# Altium project 3562.PrjPcb (part 3 of 5)

## Sheet P07_MICRO SD_FAN_ARM JTAG.SchDoc
size 420 x 297 mm
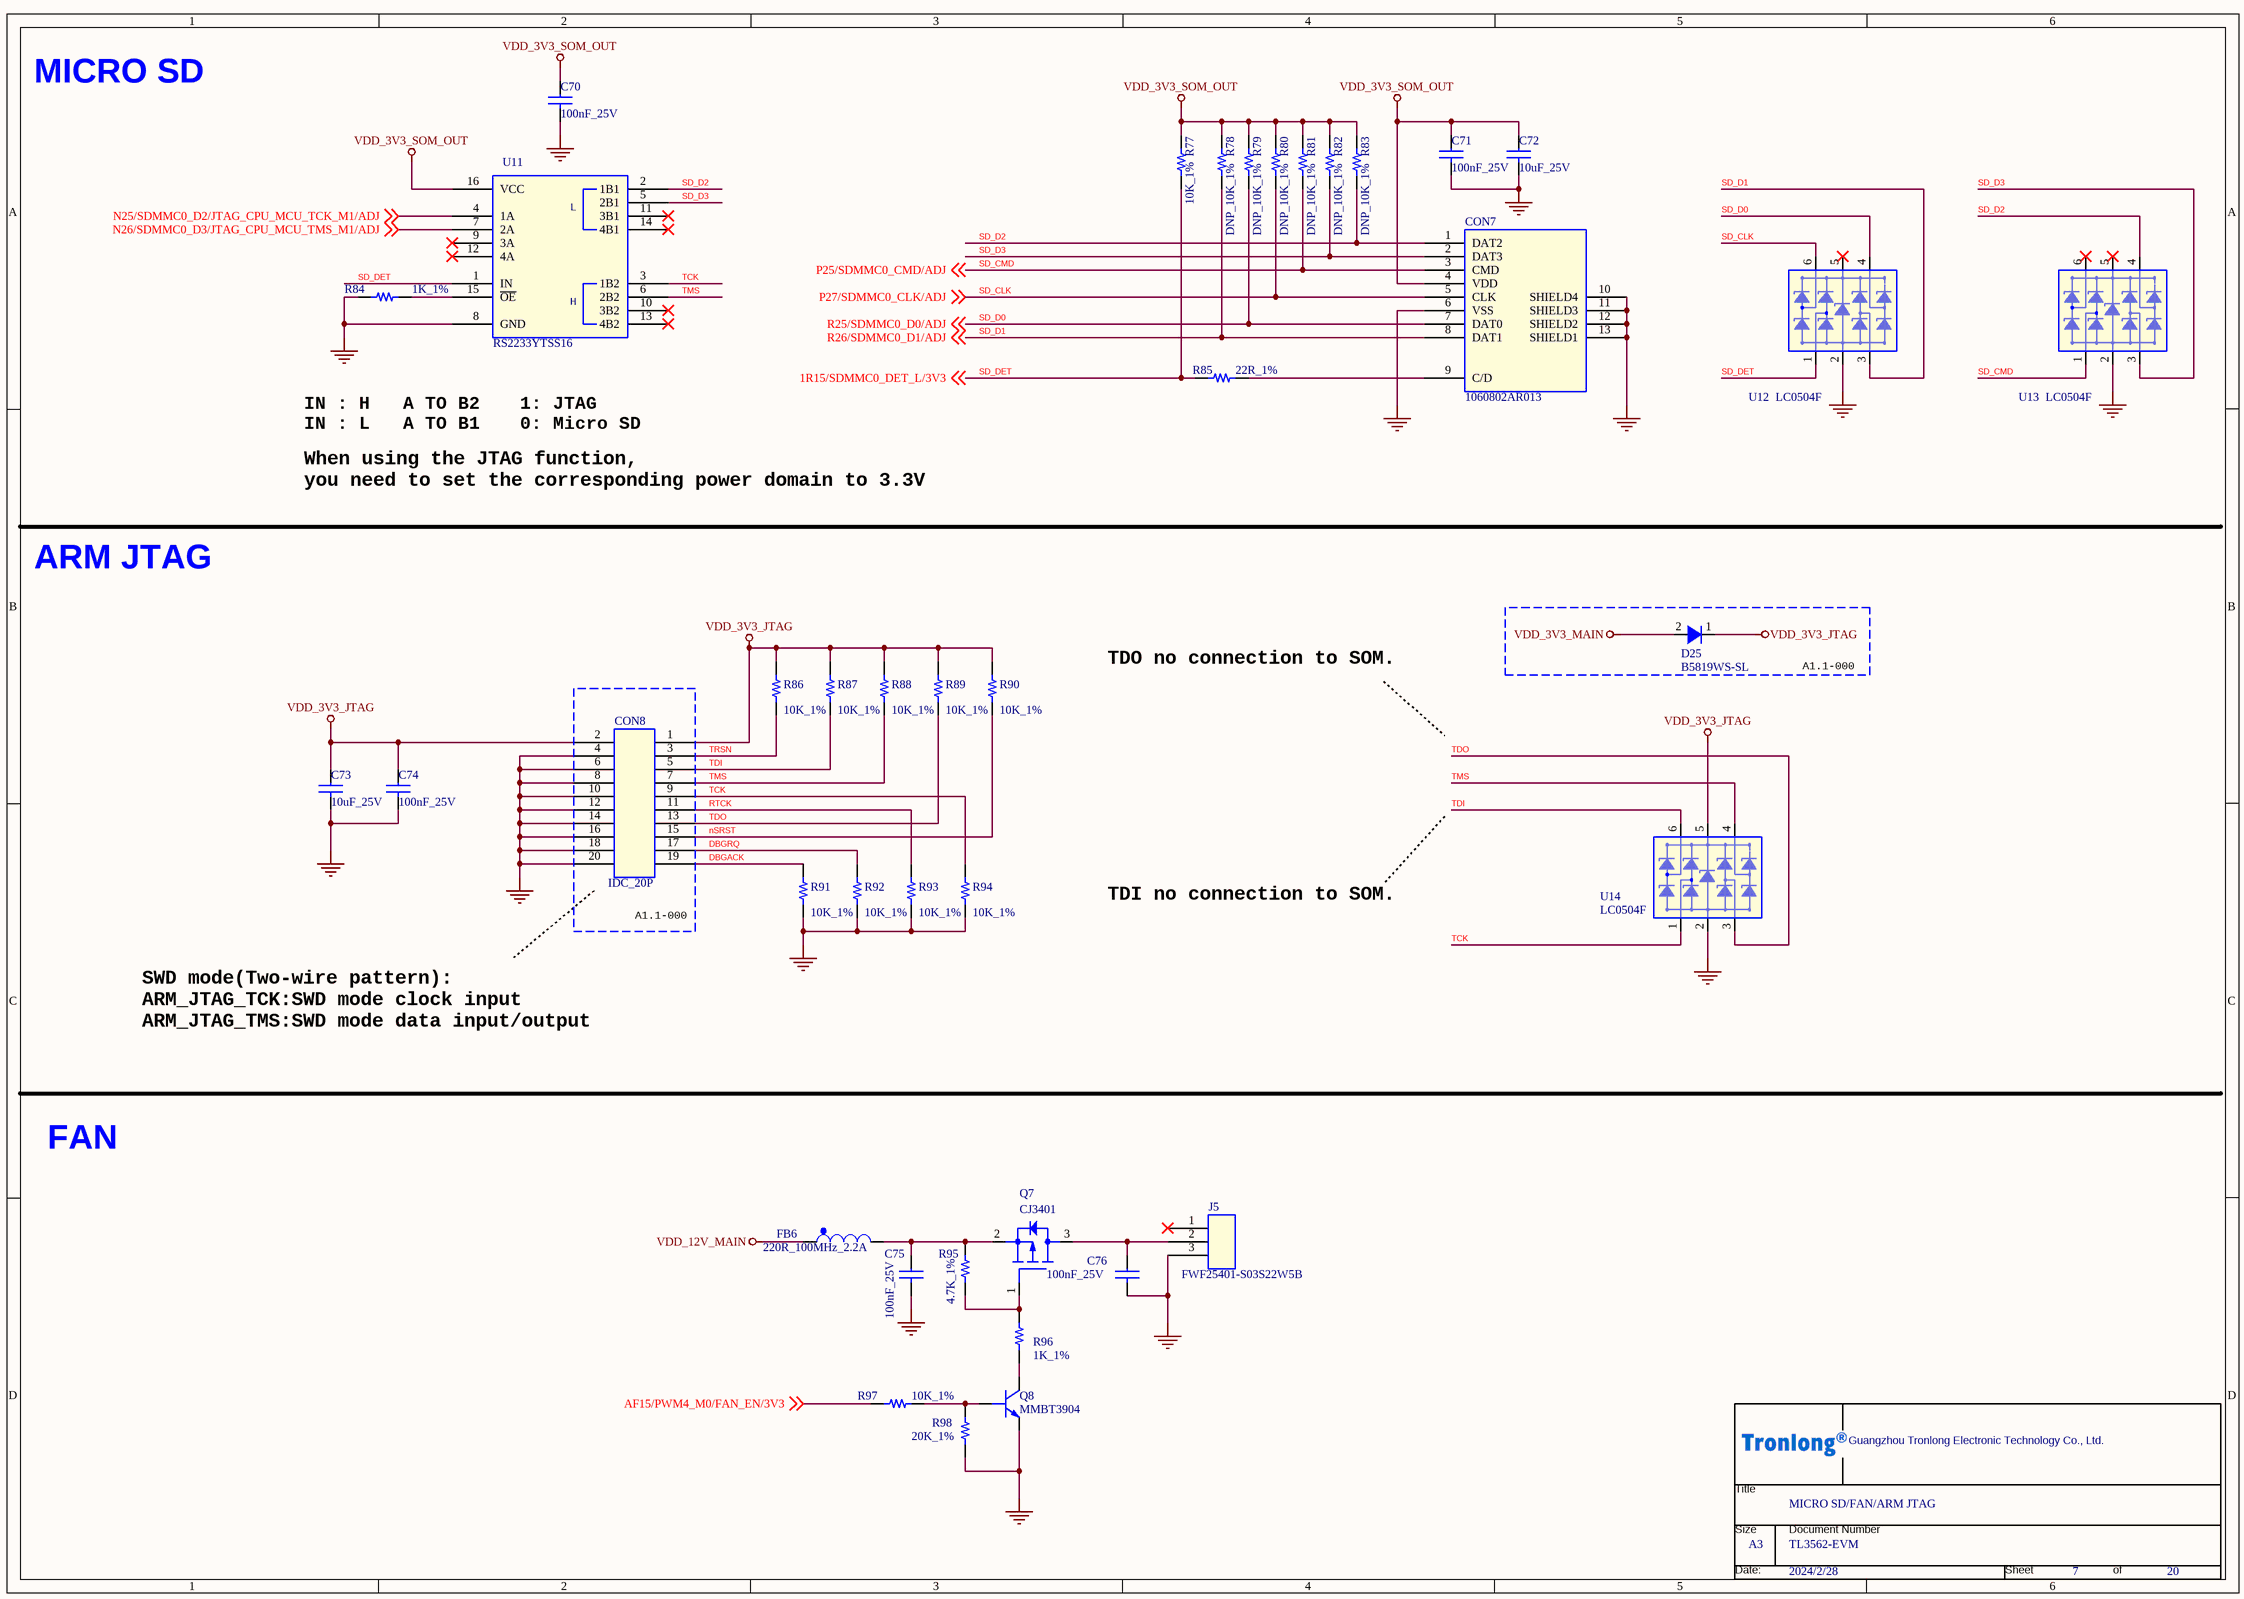
[diagram p14: P07_MICRO SD_FAN_ARM JTAG.SchDoc]

### Parts
(Parts that share a designator on the sheet are numbered #1, #2 ... from top to bottom, then left to right.)
*#7  Page Count: 20  Page Number: 7  Page Size: A3  OrgName: Guangzhou Tronlong Electronic Technology Co., Ltd.  Title: MICRO SD/FAN/ARM JTAG  Doc: TL3562-EVM  Page Modify Date: 2024/2/28  (hidden comment: Tronlong_TITTLE_20211115)  (graphical)
C70  100nF_25V  [C0402]
C71  100nF_25V  [C0402]
C72  10uF_25V  [C0603]
C73  10uF_25V  [C0603]
C74  100nF_25V  [C0402]
C75  100nF_25V  [C0402]
C76  100nF_25V  [C0402]
CON7  1060802AR013  [CON_TF_CARD]
CON8  IDC_20P  [con_2d54_2x10_th_box]
D25  B5819WS-SL  [SOD-323]
FB6  220R_100MHz_2.2A  [L0603]
J5  FWF25401-S03S22W5B  [mol22-23-2031]
Q7  CJ3401  [SOT23-3]
Q8  MMBT3904  [SOT23-3_DBZ3]
R77  10K_1%  [R0402]
R78  DNP_10K_1%  [R0402]
R79  DNP_10K_1%  [R0402]
R80  DNP_10K_1%  [R0402]
R81  DNP_10K_1%  [R0402]
R82  DNP_10K_1%  [R0402]
R83  DNP_10K_1%  [R0402]
R84  1K_1%  [R0402]
R85  22R_1%  [R0402]
R86  10K_1%  [R0402]
R87  10K_1%  [R0402]
R88  10K_1%  [R0402]
R89  10K_1%  [R0402]
R90  10K_1%  [R0402]
R91  10K_1%  [R0402]
R92  10K_1%  [R0402]
R93  10K_1%  [R0402]
R94  10K_1%  [R0402]
R95  4.7K_1%  [R0402]
R96  1K_1%  [R0402]
R97  10K_1%  [R0402]
R98  20K_1%  [R0402]
U11  RS2233YTSS16  [TSSOP16]
U12  LC0504F  [SOT363]
U13  LC0504F  [SOT363]
U14  LC0504F  [SOT363]

### Blocks framed on the sheet
A1.1-000: D25
A1.1-000: CON8

### Nets
GND: C70.2 C71.2 C72.2 C73.2 C74.2 C75.2 C76.2 CON7.6(VSS) CON7.10(SHIELD4) CON7.11(SHIELD3) CON7.12(SHIELD2) CON7.13(SHIELD1) CON8.4 CON8.6 CON8.8 CON8.10 CON8.12 CON8.14 CON8.16 CON8.18 CON8.20 J5.3 Q8.2(E) R84.2 R91.2 R92.2 R93.2 R94.2 R98.2 U11.8(GND) U12.2 U13.2 U14.2
VDD_3V3_JTAG: C73.1 C74.1 CON8.1 CON8.2 D25.1(Anode) R86.1 R87.1 R88.1 R89.1 R90.1 U14.5
VDD_3V3_MAIN: D25.2(Cathode)
VDD_3V3_SOM_OUT: C70.1 C71.1 C72.1 CON7.4(VDD) R77.1 R78.1 R79.1 R80.1 R81.1 R82.1 R83.1 U11.16(VCC)
VDD_12V_MAIN: FB6.1
AF15/PWM4_M0/FAN_EN/3V3: R97.1 ; off-sheet AF15/PWM4_M0/FAN_EN/3V3
DBGACK: CON8.19 R91.1
DBGRQ: CON8.17 R92.1
N25/SDMMC0_D2/JTAG_CPU_MCU_TCK_M1/ADJ: U11.4(1A) ; off-sheet N25/SDMMC0_D2/JTAG_CPU_MCU_TCK_M1/ADJ
N26/SDMMC0_D3/JTAG_CPU_MCU_TMS_M1/ADJ: U11.7(2A) ; off-sheet N26/SDMMC0_D3/JTAG_CPU_MCU_TMS_M1/ADJ
nSRST: CON8.15 R90.2
RTCK: CON8.11 R93.1
SD_CLK: CON7.5(CLK) R80.2 U12.6 ; off-sheet P27/SDMMC0_CLK/ADJ  [also labelled P27/SDMMC0_CLK/ADJ]
SD_CMD: CON7.3(CMD) R81.2 U13.1 ; off-sheet P25/SDMMC0_CMD/ADJ  [also labelled P25/SDMMC0_CMD/ADJ]
SD_D0: CON7.7(DAT0) R79.2 U12.4 ; off-sheet R25/SDMMC0_D0/ADJ  [also labelled R25/SDMMC0_D0/ADJ]
SD_D1: CON7.8(DAT1) R78.2 U12.3 ; off-sheet R26/SDMMC0_D1/ADJ  [also labelled R26/SDMMC0_D1/ADJ]
SD_D2: CON7.1(DAT2) R83.2 U11.2(1B1) U13.4
SD_D3: CON7.2(DAT3) R82.2 U11.5(2B1) U13.3
SD_DET: R77.2 R85.1 U11.1(IN) U12.1 ; off-sheet 1R15/SDMMC0_DET_L/3V3  [also labelled 1R15/SDMMC0_DET_L/3V3]
TCK: CON8.9 R94.1 U11.3(1B2) U14.1
TDI: CON8.5 R87.2 U14.6
TDO: CON8.13 R89.2 U14.3
TMS: CON8.7 R88.2 U11.6(2B2) U14.4
TRSN: CON8.3 R86.2
NetC75_1: C75.1 FB6.2 Q7.2(SOURCE) R95.1
NetC76_1: C76.1 J5.2 Q7.3(DRAIN)
NetCON7_9: CON7.9(C/D) R85.2
NetQ7_1: Q7.1(GATE) R95.2 R96.1
NetQ8_1: Q8.1(B) R97.2 R98.1
NetQ8_3: Q8.3(C) R96.2
NetR84_1: R84.1 U11.15(~{OE})

Not connected (* = marked no-connect by the designer): J5 1*; U11 9(3A)* 10(3B2)* 11(3B1)* 12(4A)* 13(4B2)* 14(4B1)*; U12 5*; U13 5* 6*

### Notes on the sheet
- MICRO SD
- IN : H   A TO B2
  IN : L   A TO B1
- 1: JTAG
  0: Micro SD
- When using the JTAG function,
  you need to set the corresponding power domain to 3.3V
- ARM JTAG
- TDO no connection to SOM.
- TDI no connection to SOM.
- SWD mode(Two-wire pattern):
  ARM_JTAG_TCK:SWD mode clock input
  ARM_JTAG_TMS:SWD mode data input/output
- FAN
- (in symbol Tronlong_TITTLE_20211115) Title; Size; Document Number; Date:; Sheet; of
- (in symbol TS3A5018DR_2) L; H

### Library data of the parts
*#7 = Tronlong_TITTLE_20211115: RevCode: A?; Page Create Date: March  8, 1995
C70 C71 C74-C76 = CAP NP_Dup3: 贴片陶瓷电容,100nF,10%,25V,X5R; Manufacturer Character: 中国大陆; Operation Temperature（℃）: -55~85℃; As-Welded: /; PCB Footprint: C0402
  C70: Temperature: -55~155℃
  C71 C74: Temperature: -55~125℃
C72 C73 = CAP NP_Dup3: as C61 on sheet P06_DEBUG UART_RTC_WD; PCB Footprint: C0603; Temperature: -55~125℃
CON7 = PROCONN SDC009-52-D_3: Micro SD卡座,9PIN,90度,贴片，GE- T-FLASH PUSH TYPE外焊式外壳带弹片1.80H(3U); Manufacturer: 广州高炬电子科技有限公司(TORCH); Manufacturer Character: 中国大陆; As-Welded: /; Operation Temperature（℃）: -40~85℃; Manufacturer PartNumber: 1060802AR013; Temperature: -40~85℃; PCB Footprint: CON_TF_CARD
CON8 = CON20A: 简易牛角座,2X10PIN,间距2.54MM,180度,公座,黑色,插件; Manufacturer Character: 中国大陆; Manufacturer PartNumber: FBH25401-D20S1004K6K; Manufacturer: 深圳特思嘉工业电子有限公司（TXGA）; PCB Footprint: con_2d54_2x10_th_box_90; Operation Temperature（℃）: -40~+105(Ta); As-Welded: /
D25 = Diode200mA250V_2: 肖特基二极管,VR=40V,IF=1A,VF=0.6V@1A; TIIntPartnumber: 1E0013; MfrNum: MMSD103T1G; Mfr: On Semiconductor; Manufacturer Character: 中国大陆; Manufacturer: 江苏长晶科技股份有限公司（JSCJ）; DescriptiveText: Diode 200mA 250V 1.25V Forward Drop; PCB Footprint: smd123; Cost10K: 0.07; Cost100: 0.23; Vendor: Digikey; As-Welded: /; Operation Temperature（℃）: -55~125℃; PartName: Diode200mA250V; Descriptive_Text: Diode 200mA 250V 1.25V Forward Drop; Temperature: -40~125℃; Manufacturer PartNumber: B5819WS-SL
FB6 = FB_0: 磁珠,50mΩ,2.2A,220R@100MHz; Manufacturer Character: 中国大陆; Manufacturer PartNumber: UPZ1608U221-2R2TF; Manufacturer: 深圳顺络电子股份有限公司（Sunlord）; Operation Temperature（℃）: -55~125℃; As-Welded: /; Temperature: -55~125℃; PCB Footprint: L0603
J5 = CON3: 端子座,3PIN,间距2.54MM,180度,2510连接器,白色,插件; Manufacturer Character: 中国大陆; Manufacturer: 深圳特思嘉工业电子有限公司（TXGA）; As-Welded: /; Manufacturer PartNumber: FWF25401-S03S22W5B; Temperature: -25~85℃; PCB Footprint: mol22-23-2031
Q7 = MOSFET P SOT: MOSFET,P沟道,VDSS=-30V,VGSS=±12V,ID=-4.2A,PD=0.35W,VGS(th)=-1.3V; Manufacturer Character: 中国大陆; Manufacturer: 江苏长晶科技有限公司（JSCJ）; As-Welded: /; Operation Temperature（℃）: -55~150℃; room: DCIN; Temperature: -55~150℃; Manufacturer PartNumber: CJ3401; Manufacturer Part Number: CJ3401; PCB Footprint: SOT23-3
Q8 = MMBT3904/SOT: BJT,NPN,Vceo=40V,Ic=200mA,fT=300MHz,PD=200mW; Manufacturer Character: 中国大陆; Manufacturer: 江苏长晶科技有限公司（JSCJ）; As-Welded: /; Operation Temperature（℃）: -55~150℃; Manufacturer PartNumber: MMBT3904; Temperature: -55~150℃; PCB Footprint: SOT23-3_DBZ3
R77 = Resistor_Dup3: 贴片电阻,10K,±1%,1/16W; Manufacturer Character: 中国大陆; CLASS: DISCRETE; As-Welded: /; room: 485-5; Operation Temperature（℃）: -55~155℃; PCB Footprint: R0402; Temperature: -55~155℃
R78-R83 = Resistor_Dup3: 贴片电阻,10K,±1%,1/16W; Manufacturer Character: 中国大陆; CLASS: DISCRETE; As-Welded: DNP; Operation Temperature（℃）: -55~155℃; PCB Footprint: R0402; Temperature: –55~155℃
R84 = Resistor_Dup3: 贴片电阻,1K,±1%,1/16W; Manufacturer Character: 中国大陆; CLASS: DISCRETE; room: JTAG_DSP; Operation Temperature（℃）: -55~155℃; As-Welded: /; PCB Footprint: R0402
R85 = Resistor_Dup3: 贴片电阻,22R,±1%,1/16W; Manufacturer Character: 中国大陆; CLASS: DISCRETE; As-Welded: /; Operation Temperature（℃）: -55~155℃; PCB Footprint: R0402; Temperature: -55~155℃
R86-R94 = Resistor_Dup3: 贴片电阻,10K,±1%,1/16W; Manufacturer Character: 中国大陆; CLASS: DISCRETE; room: 485-5; Operation Temperature（℃）: -55~155℃; As-Welded: /; Temperature: -55~155℃; PCB Footprint: R0402
R95 = Resistor_Dup3: 贴片电阻,4.7K,±1%,1/16W; Manufacturer Character: 中国大陆; Mistral Part No: 110009031036-R; Mfr_name: PANASONIC-ECG; Mfr_part_number: ERJ-2RNF6981V; Part_type: RESISTORS\FIXED; CLASS: DISCRETE; Operation Temperature（℃）: -55~155℃; As-Welded: /; Project: TELEMETRY ENCODER; Customs_HS_Code: 85332119; Custom_Duty: 15%; PCB Footprint: R0402; Tolerance: 1%; Wattage: 1/16W; Package: 0402; Distributor_name: NA; Distributor_part_number: NA; Height: 0.40MM; Datasheet: Y:\MIS_DATABASE\DATASHEETS\RESISTORS\PAN_ERJ.PDF; Crtd /date: MAZHAR/090807; Chkd/date: SHREESHAIL/100807
R96 = Resistor_Dup3: 贴片电阻,1K,±1%,1/16W; Part_type: RESISTORS\FIXED; Mfr_part_number: ERJ-2RNF6981V; Mfr_name: PANASONIC-ECG; Mistral Part No: 110009031036-R; Manufacturer Character: 中国大陆; CLASS: DISCRETE; Custom_Duty: 15%; Customs_HS_Code: 85332119; Project: TELEMETRY ENCODER; As-Welded: /; Operation Temperature（℃）: -55~155℃; PCB Footprint: R0402; Chkd/date: SHREESHAIL/100807; Crtd /date: MAZHAR/090807; Datasheet: Y:\MIS_DATABASE\DATASHEETS\RESISTORS\PAN_ERJ.PDF; Height: 0.40MM; Distributor_part_number: NA; Distributor_name: NA; Package: 0402; Wattage: 1/16W; Tolerance: 1%
R97 = Resistor_Dup3: 贴片电阻,10K,±1%,1/16W; Mistral Part No: 110009031036-R; Mfr_name: PANASONIC-ECG; Mfr_part_number: ERJ-2RNF6981V; Part_type: RESISTORS\FIXED; Manufacturer Character: 中国大陆; CLASS: DISCRETE; Project: TELEMETRY ENCODER; Customs_HS_Code: 85332119; Custom_Duty: 15%; As-Welded: /; Operation Temperature（℃）: -55~155℃; PCB Footprint: R0402; Tolerance: 1%; Wattage: 1/16W; Package: 0402; Distributor_name: NA; Distributor_part_number: NA; Height: 0.40MM; Datasheet: Y:\MIS_DATABASE\DATASHEETS\RESISTORS\PAN_ERJ.PDF; Crtd /date: MAZHAR/090807; Chkd/date: SHREESHAIL/100807
R98 = Resistor_Dup3: 贴片电阻,20K,±1%,1/16W; Manufacturer Character: 中国大陆; Part_type: RESISTORS\FIXED; Mfr_part_number: ERJ-2RNF6981V; Mfr_name: PANASONIC-ECG; Mistral Part No: 110009031036-R; CLASS: DISCRETE; Operation Temperature（℃）: -55~155℃; As-Welded: /; Custom_Duty: 15%; Customs_HS_Code: 85332119; Project: TELEMETRY ENCODER; Chkd/date: SHREESHAIL/100807; Crtd /date: MAZHAR/090807; Datasheet: Y:\MIS_DATABASE\DATASHEETS\RESISTORS\PAN_ERJ.PDF; Height: 0.40MM; Distributor_part_number: NA; Distributor_name: NA; Package: 0402; Wattage: 1/16W; Tolerance: 1%; PCB Footprint: R0402
U11 = TS3A5018DR_2: 4路模拟开关芯片; Manufacturer: 江苏润石科技有限公司（RUNIC）; Manufacturer Character: 中国大陆; Operation Temperature（℃）: -40~85℃; room: JTAG_DSP; As-Welded: /; Temperature: -40~85℃; Manufacturer PartNumber: RS2233YTSS16; PCB Footprint: TSSOP16
U12 = PRTR5V0U4Y_0: ESD二极管,VRWM=5V,VBR=6V,四组,单向,8KV,15KV; Manufacturer: 上海雷卯电子科技有限公司（Leiditech）; Manufacturer Character: 中国大陆; As-Welded: /; Operation Temperature（℃）: -55~125℃; room: SD; Temperature: -40~85℃; Manufacturer PartNumber: LC0504F; Manufacturer Part Number: PRTR5V0U4Y; PCB Footprint: SOT363
U13 = PRTR5V0U4Y_0: ESD二极管,VRWM=5V,VBR=6V,四组,单向,8KV,15KV; Manufacturer Character: 中国大陆; Manufacturer: 上海雷卯电子科技有限公司（Leiditech）; As-Welded: /; Operation Temperature（℃）: -55~125℃; room: SD; Temperature: -40~85℃; Manufacturer PartNumber: LC0504F; Manufacturer Part Number: PRTR5V0U4Y; PCB Footprint: SOT363
U14 = PRTR5V0U4Y_0: ESD二极管,VRWM=5V,VBR=6V,四组,单向,8KV,15KV; Manufacturer Character: 中国大陆; Manufacturer: 上海雷卯电子科技有限公司（Leiditech）; room: SD; Operation Temperature（℃）: -55~125℃; As-Welded: /; PCB Footprint: SOT363; Temperature: -40~85℃; Manufacturer PartNumber: LC0504F; Manufacturer Part Number: PRTR5V0U4Y

## Sheet P08_RS485_RS232_CAN.SchDoc
size 594 x 420 mm
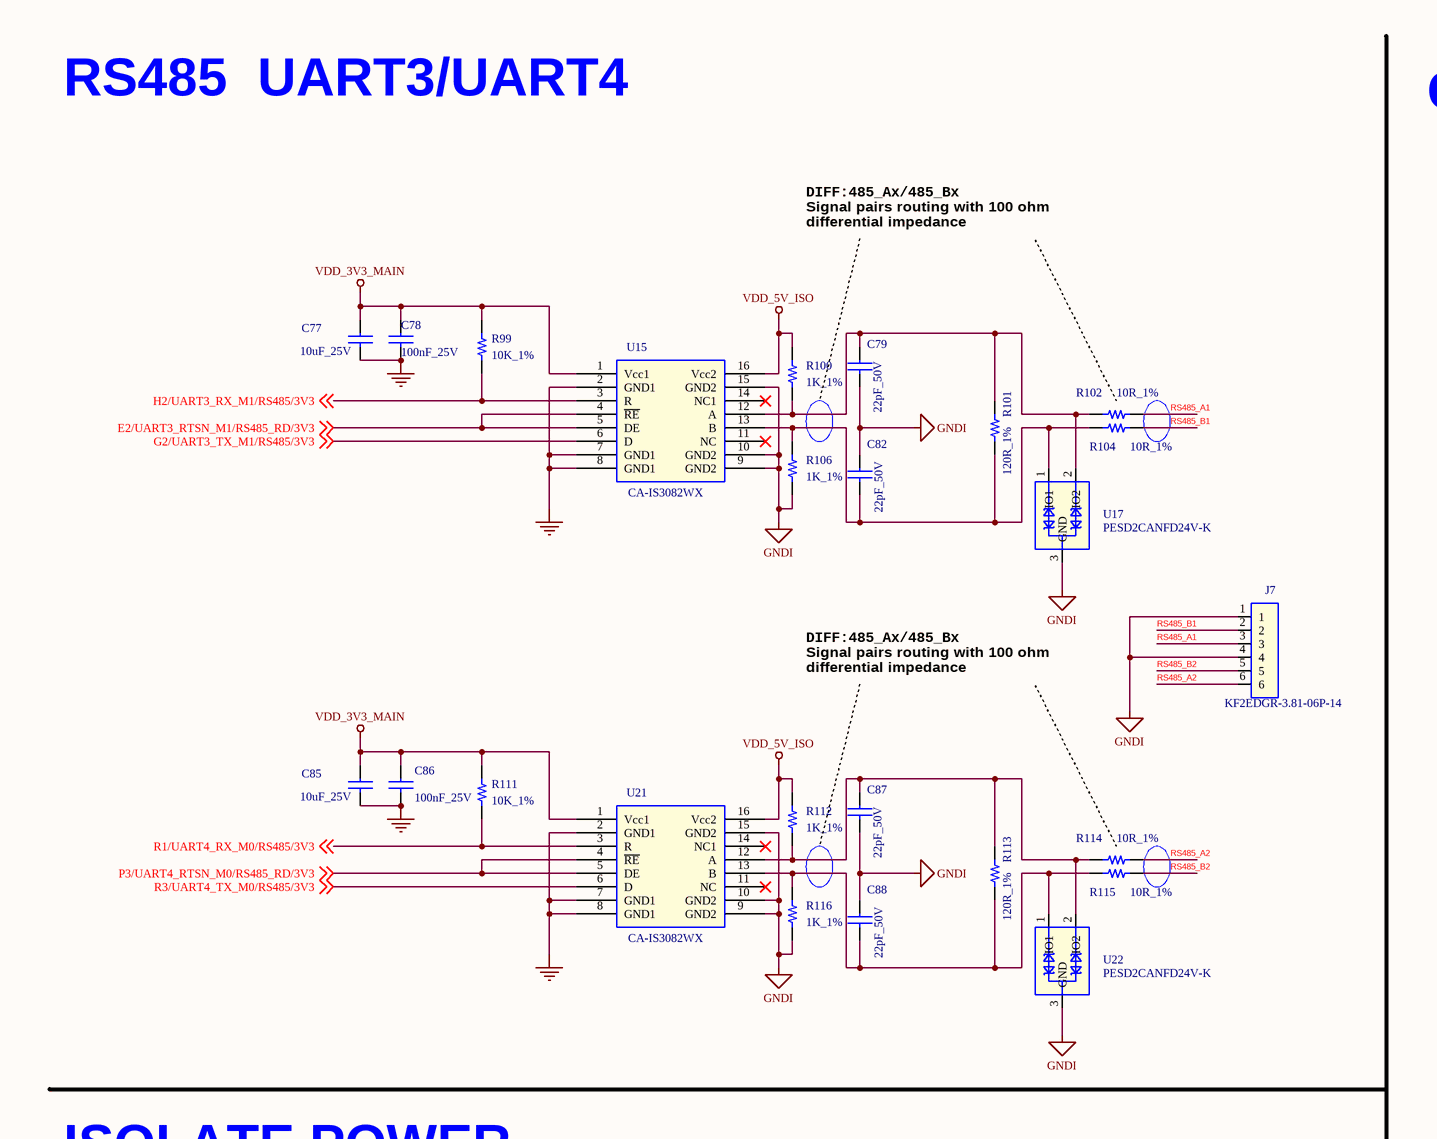
[diagram p15: P08_RS485_RS232_CAN.SchDoc, top left]
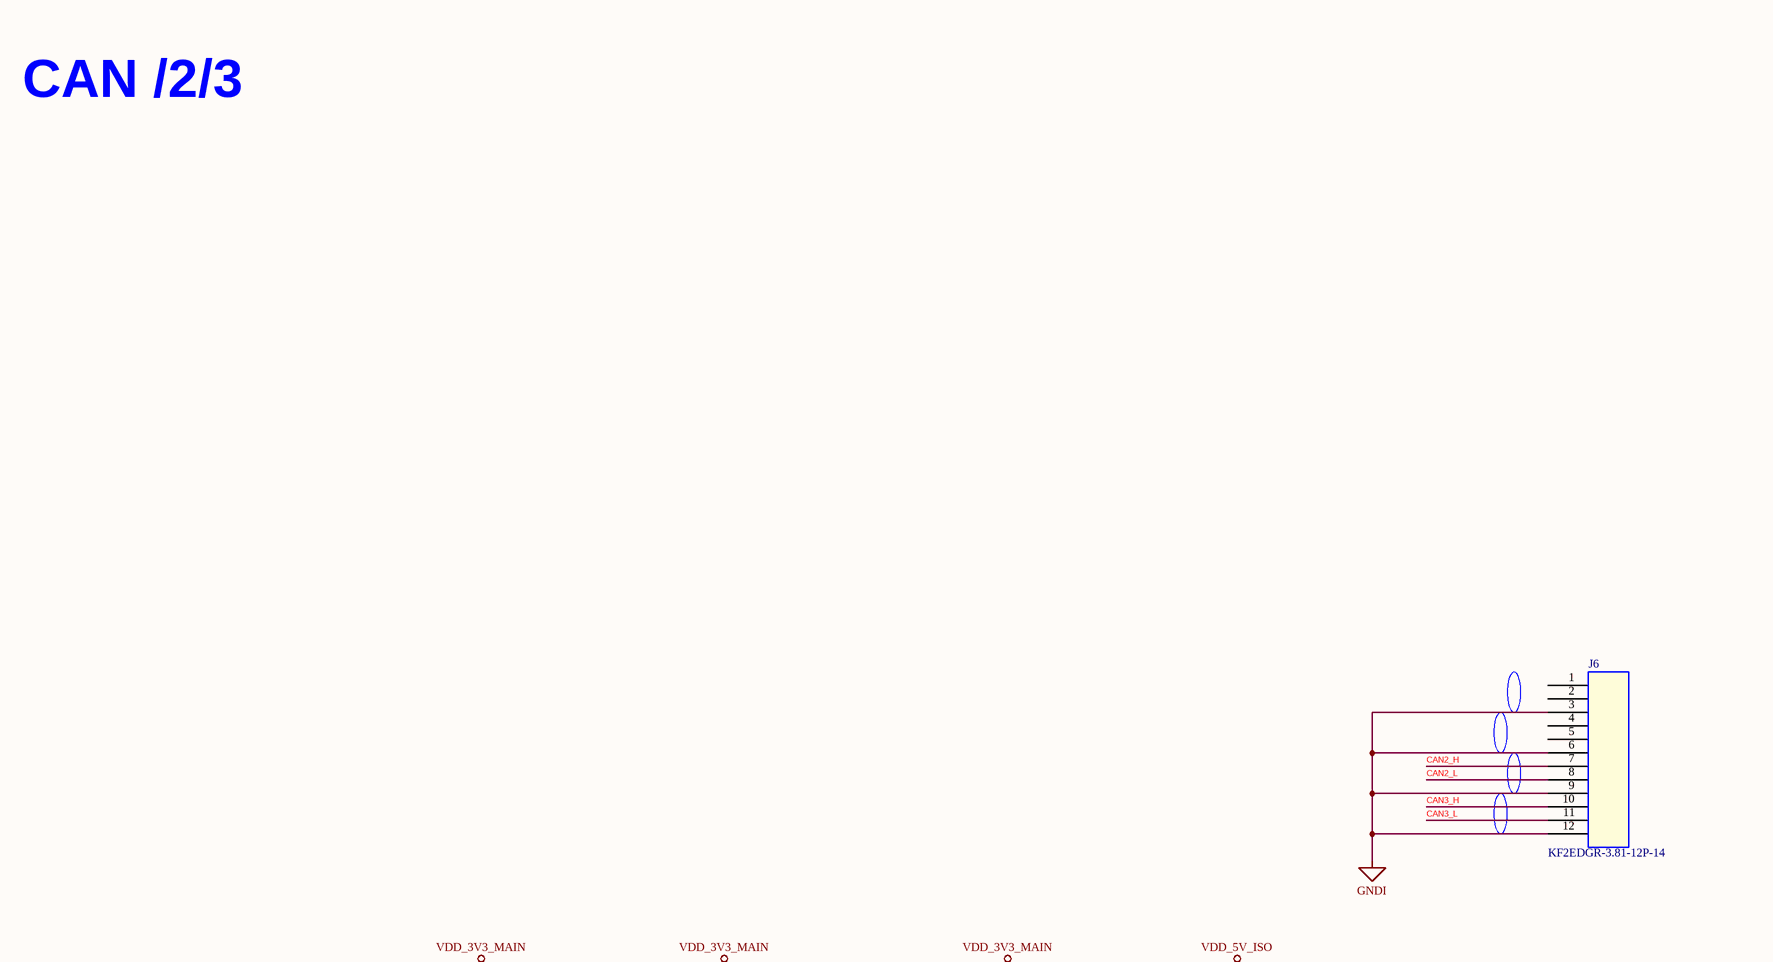
[diagram p16: P08_RS485_RS232_CAN.SchDoc, top right]
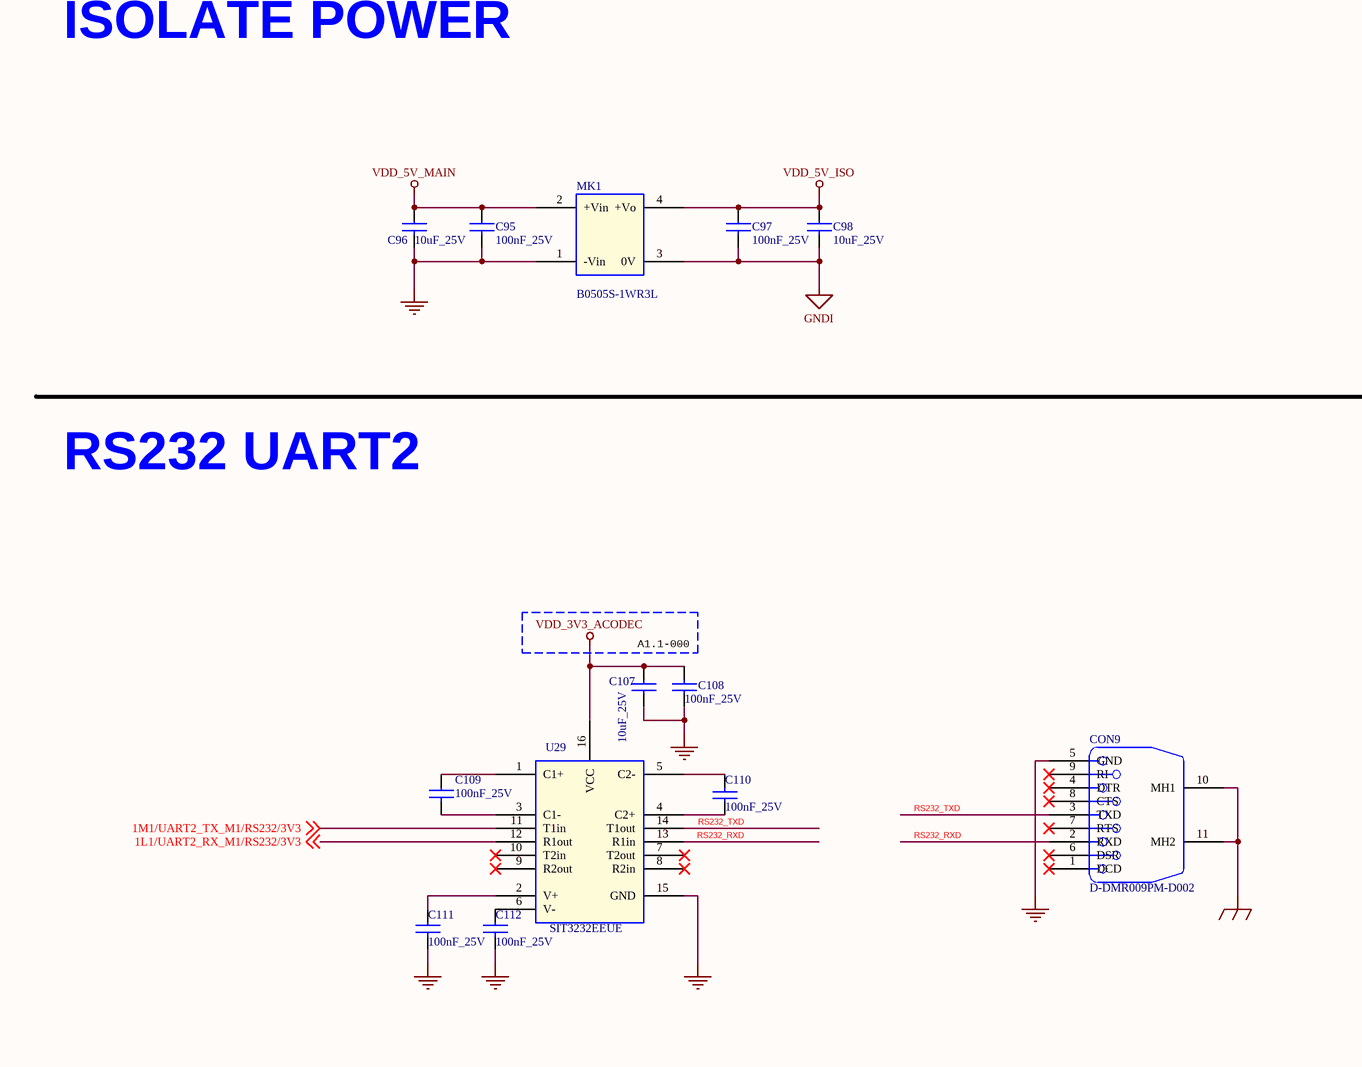
[diagram p17: P08_RS485_RS232_CAN.SchDoc, bottom left]
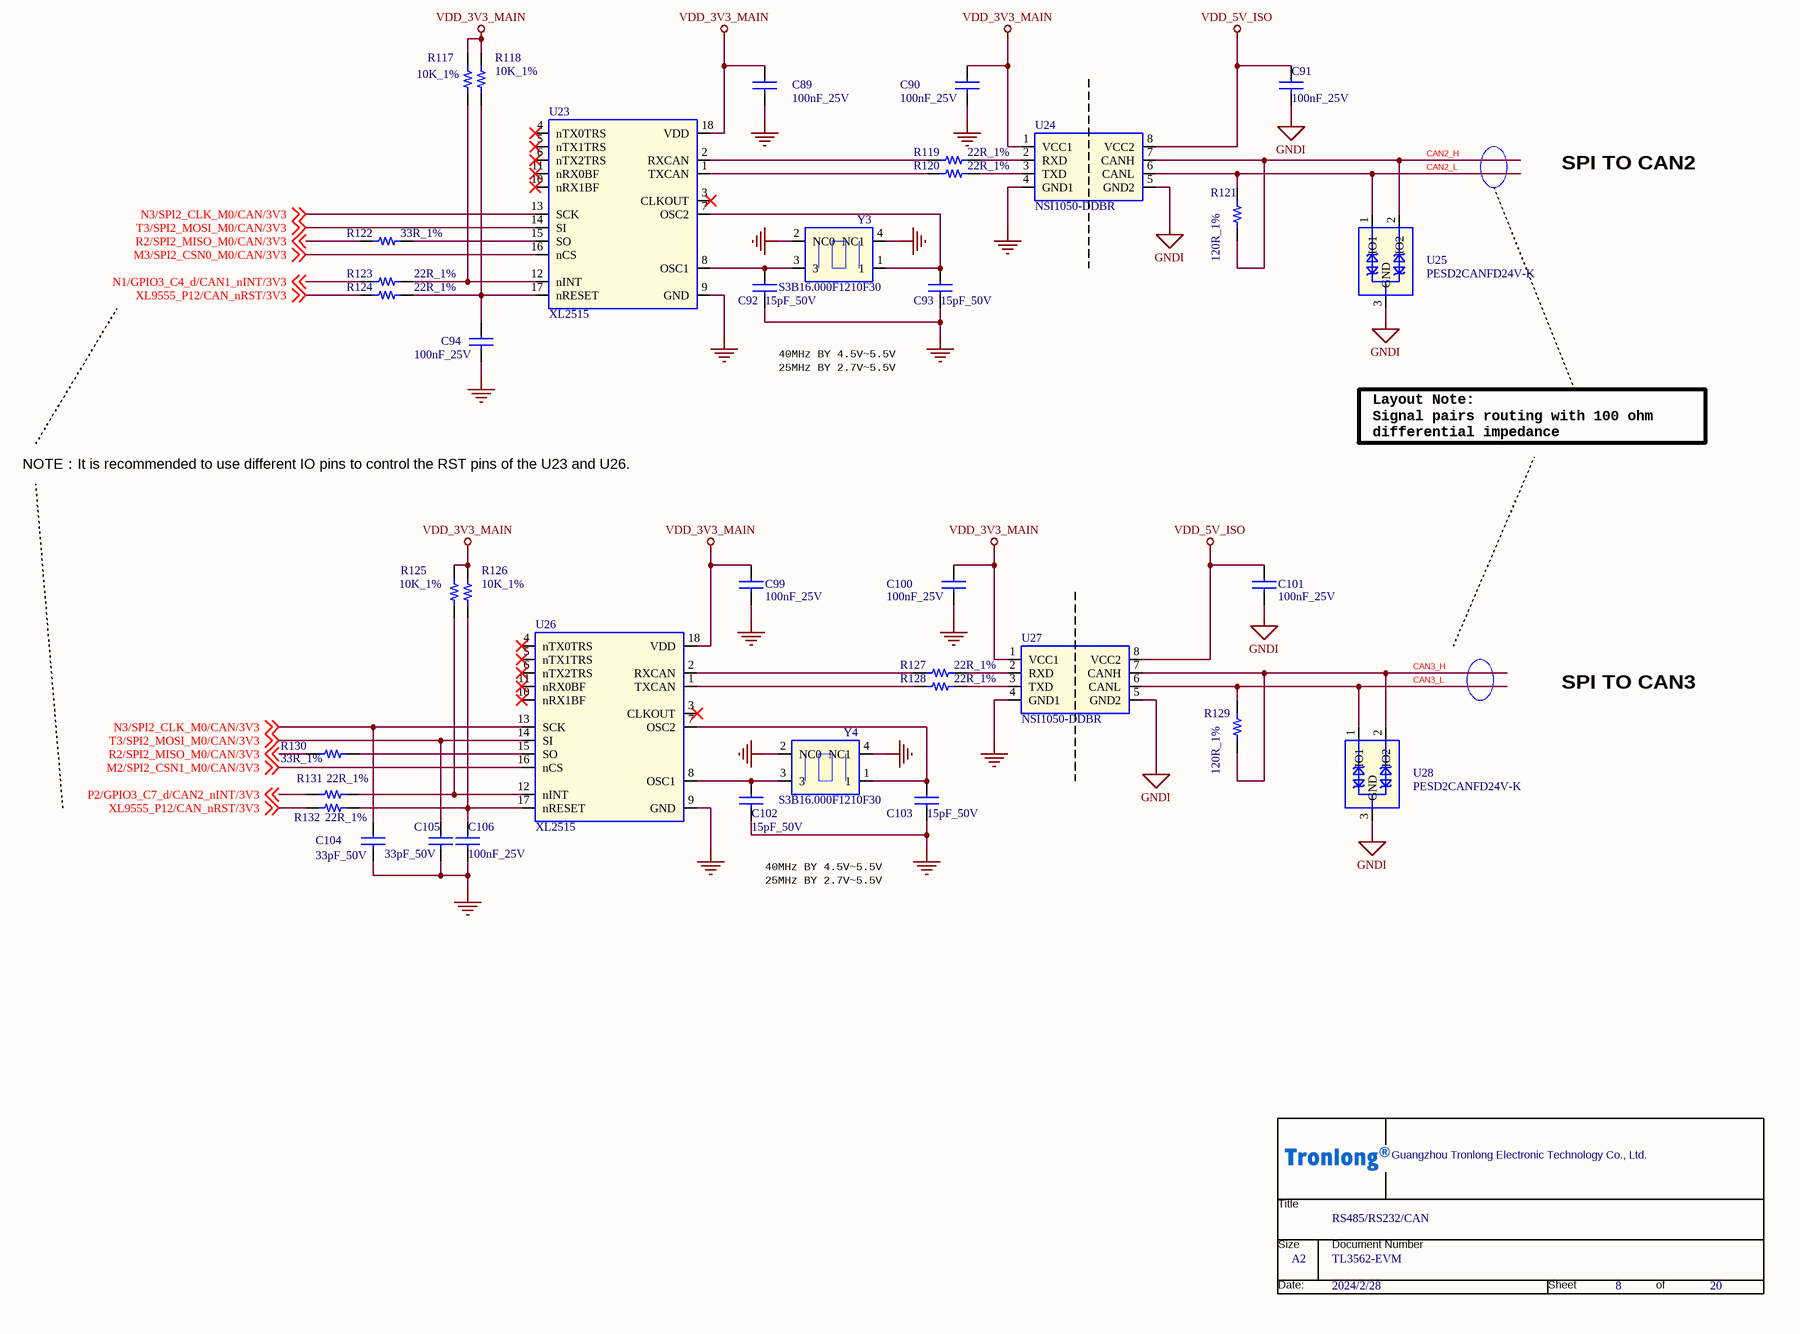
[diagram p18: P08_RS485_RS232_CAN.SchDoc, bottom right]

### Parts
(Parts that share a designator on the sheet are numbered #1, #2 ... from top to bottom, then left to right.)
*#8  Page Count: 20  Page Number: 8  Page Size: A2  OrgName: Guangzhou Tronlong Electronic Technology Co., Ltd.  Title: RS485/RS232/CAN  Doc: TL3562-EVM  Page Modify Date: 2024/2/28  (hidden comment: Tronlong_TITTLE_20211115)  (graphical)
C77  10uF_25V  [C0603]
C78  100nF_25V  [C0402]
C79  22pF_50V  [C0603]
C82  22pF_50V  [C0603]
C85  10uF_25V  [C0603]
C86  100nF_25V  [C0402]
C87  22pF_50V  [C0603]
C88  22pF_50V  [C0603]
C89  100nF_25V  [C0402]
C90  100nF_25V  [C0402]
C91  100nF_25V  [C0402]
C92  15pF_50V  [C0402]
C93  15pF_50V  [C0402]
C94  100nF_25V  [C0402]
C95  100nF_25V  [C0402]
C96  10uF_25V  [C0603]
C97  100nF_25V  [C0402]
C98  10uF_25V  [C0603]
C99  100nF_25V  [C0402]
C100  100nF_25V  [C0402]
C101  100nF_25V  [C0402]
C102  15pF_50V  [C0402]
C103  15pF_50V  [C0402]
C104  33pF_50V  [C0603]
C105  33pF_50V  [C0603]
C106  100nF_25V  [C0402]
C107  10uF_25V  [C0603]
C108  100nF_25V  [C0402]
C109  100nF_25V  [C0402]
C110  100nF_25V  [C0402]
C111  100nF_25V  [C0402]
C112  100nF_25V  [C0402]
CON9  D-DMR009PM-D002  [CON_DB9]
J6  KF2EDGR-3.81-12P-14  [KF2EDGR-3d81-12P]
J7  KF2EDGR-3.81-06P-14  [kf2eg_3_81-6p]
MK1  B0505S-1WR3L  [DIP4_B0505S_1W]
R99  10K_1%  [R0402]
R100  1K_1%  [R0402]
R101  120R_1%  [R0805]
R102  10R_1%  [R0603]
R104  10R_1%  [R0603]
R106  1K_1%  [R0402]
R111  10K_1%  [R0402]
R112  1K_1%  [R0402]
R113  120R_1%  [R0805]
R114  10R_1%  [R0603]
R115  10R_1%  [R0603]
R116  1K_1%  [R0402]
R117  10K_1%  [R0402]
R118  10K_1%  [R0402]
R119  22R_1%  [R0402]
R120  22R_1%  [R0402]
R121  120R_1%  [R0805]
R122  33R_1%  [R0402]
R123  22R_1%  [R0402]
R124  22R_1%  [R0402]
R125  10K_1%  [R0402]
R126  10K_1%  [R0402]
R127  22R_1%  [R0402]
R128  22R_1%  [R0402]
R129  120R_1%  [R0805]
R130  33R_1%  [R0402]
R131  22R_1%  [R0402]
R132  22R_1%  [R0402]
U15  CA-IS3082WX  [SOIC16]
U17  PESD2CANFD24V-K  [SOT23-3]
U21  CA-IS3082WX  [SOIC16]
U22  PESD2CANFD24V-K  [SOT23-3]
U23  XL2515  [SOIC18]
U24  NSI1050-DDBR  [SOP8]
U25  PESD2CANFD24V-K  [SOT23-3]
U26  XL2515  [SOIC18]
U27  NSI1050-DDBR  [SOP8]
U28  PESD2CANFD24V-K  [SOT23-3]
U29  SIT3232EEUE  [TSSOP16_PW16]
Y3  S3B16.000F1210F30  [SMD_3225]
Y4  S3B16.000F1210F30  [SMD_3225]

### Nets
EGND: CON9.10(MH1) CON9.11(MH2)
GND: C77.2 C78.2 C85.2 C86.2 C89.2 C90.2 C92.2 C93.2 C94.2 C95.2 C96.2 C99.2 C100.2 C102.2 C103.2 C104.2 C105.2 C106.2 C107.1 C108.1 C111.2 C112.2 CON9.5(GND) MK1.1(-Vin) U15.2(GND1) U15.7(GND1) U15.8(GND1) U21.2(GND1) U21.7(GND1) U21.8(GND1) U23.9(GND) U24.4(GND1) U26.9(GND) U27.4(GND1) U29.15(GND) Y3.2(NC0) Y3.4(NC1) Y4.2(NC0) Y4.4(NC1)
GNDI: C79.2 C82.1 C87.2 C88.1 C91.2 C97.2 C98.2 C101.2 J6.3 J6.6 J6.9 J6.12 J7.1 J7.4 MK1.3(0V) R106.2 R116.2 U15.9(GND2) U15.10(GND2) U15.15(GND2) U17.3(GND) U21.9(GND2) U21.10(GND2) U21.15(GND2) U22.3(GND) U24.5(GND2) U25.3(GND) U27.5(GND2) U28.3(GND)
VDD_3V3_ACODEC: C107.2 C108.2 U29.16(VCC)
VDD_3V3_MAIN: C77.1 C78.1 C85.1 C86.1 C89.1 C90.1 C99.1 C100.1 R99.1 R111.1 R117.2 R118.2 R125.2 R126.2 U15.1(Vcc1) U21.1(Vcc1) U23.18(VDD) U24.1(VCC1) U26.18(VDD) U27.1(VCC1)
VDD_5V_ISO: C91.1 C97.1 C98.1 C101.1 MK1.4(+Vo) R100.1 R112.1 U15.16(Vcc2) U21.16(Vcc2) U24.8(VCC2) U27.8(VCC2)
VDD_5V_MAIN: C95.1 C96.1 MK1.2(+Vin)
1L1/UART2_RX_M1/RS232/3V3: U29.12(R1out) ; off-sheet 1L1/UART2_RX_M1/RS232/3V3
1M1/UART2_TX_M1/RS232/3V3: U29.11(T1in) ; off-sheet 1M1/UART2_TX_M1/RS232/3V3
CAN2_H: J6.7 R121.1 U24.7(CANH) U25.2(IO2)
CAN2_L: J6.8 R121.2 U24.6(CANL) U25.1(IO1)
CAN3_H: J6.10 R129.1 U27.7(CANH) U28.2(IO2)
CAN3_L: J6.11 R129.2 U27.6(CANL) U28.1(IO1)
E2/UART3_RTSN_M1/RS485_RD/3V3: U15.4(~{RE}) U15.5(DE) ; off-sheet E2/UART3_RTSN_M1/RS485_RD/3V3
G2/UART3_TX_M1/RS485/3V3: U15.6(D) ; off-sheet G2/UART3_TX_M1/RS485/3V3
H2/UART3_RX_M1/RS485/3V3: R99.2 U15.3(R) ; off-sheet H2/UART3_RX_M1/RS485/3V3
M2/SPI2_CSN1_M0/CAN/3V3: U26.16(nCS) ; off-sheet M2/SPI2_CSN1_M0/CAN/3V3
M3/SPI2_CSN0_M0/CAN/3V3: U23.16(nCS) ; off-sheet M3/SPI2_CSN0_M0/CAN/3V3
N1/GPIO3_C4_d/CAN1_nINT/3V3: R123.1 ; off-sheet N1/GPIO3_C4_d/CAN1_nINT/3V3
N3/SPI2_CLK_M0/CAN/3V3: C104.1 U23.13(SCK) U26.13(SCK) ; off-sheet N3/SPI2_CLK_M0/CAN/3V3
P2/GPIO3_C7_d/CAN2_nINT/3V3: R131.1 ; off-sheet P2/GPIO3_C7_d/CAN2_nINT/3V3
P3/UART4_RTSN_M0/RS485_RD/3V3: U21.4(~{RE}) U21.5(DE) ; off-sheet P3/UART4_RTSN_M0/RS485_RD/3V3
R1/UART4_RX_M0/RS485/3V3: R111.2 U21.3(R) ; off-sheet R1/UART4_RX_M0/RS485/3V3
R2/SPI2_MISO_M0/CAN/3V3: R122.1 R130.1 ; off-sheet R2/SPI2_MISO_M0/CAN/3V3
R3/UART4_TX_M0/RS485/3V3: U21.6(D) ; off-sheet R3/UART4_TX_M0/RS485/3V3
RS232_RXD: CON9.2(RXD) U29.13(R1in)
RS232_TXD: CON9.3(TXD) U29.14(T1out)
RS485_A1: J7.3 R102.1
RS485_A2: J7.6 R114.1
RS485_B1: J7.2 R104.1
RS485_B2: J7.5 R115.1
T3/SPI2_MOSI_M0/CAN/3V3: C105.1 U23.14(SI) U26.14(SI) ; off-sheet T3/SPI2_MOSI_M0/CAN/3V3
XL9555_P12/CAN_nRST/3V3: R124.1 R132.1 ; off-sheet XL9555_P12/CAN_nRST/3V3
NetC79_1: C79.1 R100.2 R101.1 R102.2 U15.12(A) U17.2(IO2)
NetC82_2: C82.2 R101.2 R104.2 R106.1 U15.13(B) U17.1(IO1)
NetC87_1: C87.1 R112.2 R113.1 R114.2 U21.12(A) U22.2(IO2)
NetC88_2: C88.2 R113.2 R115.2 R116.1 U21.13(B) U22.1(IO1)
NetC92_1: C92.1 U23.8(OSC1) Y3.3
NetC93_1: C93.1 U23.7(OSC2) Y3.1
NetC94_1: C94.1 R118.1 R124.2 U23.17(nRESET)
NetC102_1: C102.1 U26.8(OSC1) Y4.3
NetC103_1: C103.1 U26.7(OSC2) Y4.1
NetC106_1: C106.1 R126.1 R132.2 U26.17(nRESET)
NetC109_1: C109.1 U29.1(C1+)
NetC109_2: C109.2 U29.3(C1-)
NetC110_1: C110.1 U29.4(C2+)
NetC110_2: C110.2 U29.5(C2-)
NetC111_1: C111.1 U29.2(V+)
NetC112_1: C112.1 U29.6(V-)
NetR117_1: R117.1 R123.2 U23.12(nINT)
NetR119_1: R119.1 U23.2(RXCAN)
NetR119_2: R119.2 U24.2(RXD)
NetR120_1: R120.1 U23.1(TXCAN)
NetR120_2: R120.2 U24.3(TXD)
NetR122_2: R122.2 U23.15(SO)
NetR125_1: R125.1 R131.2 U26.12(nINT)
NetR127_1: R127.1 U26.2(RXCAN)
NetR127_2: R127.2 U27.2(RXD)
NetR128_1: R128.1 U26.1(TXCAN)
NetR128_2: R128.2 U27.3(TXD)
NetR130_2: R130.2 U26.15(SO)

Not connected (* = marked no-connect by the designer): CON9 1(DCD)* 4(DTR)* 6(DSR)* 7(RTS)* 8(CTS)* 9(RI)*; J6 1 2 4 5; U15 11(NC)* 14(NC1)*; U21 11(NC)* 14(NC1)*; U23 3(CLKOUT)* 4(nTX0TRS)* 5(nTX1TRS)* 6(nTX2TRS)* 10(nRX1BF)* 11(nRX0BF)*; U26 3(CLKOUT)* 4(nTX0TRS)* 5(nTX1TRS)* 6(nTX2TRS)* 10(nRX1BF)* 11(nRX0BF)*; U29 7(T2out)* 8(R2in)* 9(R2out)* 10(T2in)*

### Notes on the sheet
- RS485  UART3/UART4
- CAN /2/3
- DIFF:485_Ax/485_Bx
- Signal pairs routing with 100 ohm
  differential impedance
- SPI TO CAN2
- ISOLATE POWER
- 25MHz BY 2.7V~5.5V
- 40MHz BY 4.5V~5.5V
- Layout Note:
  Signal pairs routing with 100 ohm
  differential impedance
- NOTE：It is recommended to use different IO pins to control the RST pins of the U23 and U26.
- RS232 UART2
- SPI TO CAN3
- A1.1-000
- (in symbol Tronlong_TITTLE_20211115) Title; Size; Document Number; Date:; Sheet; of

### Library data of the parts
*#8 = Tronlong_TITTLE_20211115: RevCode: A?; Page Create Date: March  8, 1995
C77 C85 C98 = CAP NP_Dup3: 贴片陶瓷电容,10uF,10%,10V,X5R; Manufacturer Character: 中国大陆; As-Welded: /; room: 6; Operation Temperature（℃）: -55~85℃; PCB Footprint: C0603; Temperature: -55~125℃
C78 C86 = CAP NP_Dup3: 贴片陶瓷电容,100nF,10%,25V,X5R; Manufacturer Character: 中国大陆; room: 6; Operation Temperature（℃）: -55~85℃; As-Welded: /; PCB Footprint: C0402; Temperature: -55~125℃
C79 C82 C87 = CAP NP_Dup3: 贴片陶瓷电容,22pF,5%,50V,C0G; Manufacturer Character: 中国大陆; Operation Temperature（℃）: -55~125℃; room: 6; As-Welded: /; PCB Footprint: C0603; Temperature: -55~125℃
C88 = CAP NP_Dup3: 贴片陶瓷电容,22pF,5%,50V,C0G; Manufacturer Character: 中国大陆; room: 6; Operation Temperature（℃）: -55~125℃; As-Welded: /; PCB Footprint: C0603; Temperature: -55~125℃
C89-C91 C94 C99-C101 C106 = CAP NP_Dup1: 贴片陶瓷电容,100nF,10%,25V,X5R; Manufacturer Character: 中国大陆; Operation Temperature（℃）: -55~85℃; As-Welded: /; PCB Footprint: C0402; Temperature: -55~125℃
C92 C93 C102 = CAP NP_Dup1: 贴片陶瓷电容,15pF,5%,50V,COG; Manufacturer Character: 中国大陆; As-Welded: /; Operation Temperature（℃）: -55~125℃; PCB Footprint: C0402; Temperature: -55~125℃
C95 C97 = CAP NP_Dup3: 贴片陶瓷电容,100nF,10%,25V,X5R; Manufacturer Character: 中国大陆; Operation Temperature（℃）: -55~85℃; room: 17; As-Welded: /; PCB Footprint: C0402; Temperature: -55~125℃
C96 = CAP NP_Dup3: 贴片陶瓷电容,10uF,10%,10V,X5R; Manufacturer Character: 中国大陆; As-Welded: /; Operation Temperature（℃）: -55~85℃; room: 6; PCB Footprint: C0603; Temperature: -55~125℃
C103 = CAP NP_Dup1: 贴片陶瓷电容,15pF,5%,50V,COG; Manufacturer Character: 中国大陆; Operation Temperature（℃）: -55~125℃; As-Welded: /; Temperature: -55~125℃; PCB Footprint: C0402
C104 C105 = CAP NP_Dup1: 贴片陶瓷电容,33pF,5%,50V,COG; Manufacturer Character: 中国大陆; Operation Temperature（℃）: -55~125℃; As-Welded: /; PCB Footprint: C0603; Temperature: -55~125℃
C107 = CAP NP_Dup3: 贴片陶瓷电容,10uF,10%,10V,X5R; Manufacturer Character: 中国大陆; As-Welded: /; room: RS232; Operation Temperature（℃）: -55~85℃; PCB Footprint: C0603; Temperature: -55~125℃
C108 = CAP NP_Dup3: 贴片陶瓷电容,100nF,10%,25V,X5R; Manufacturer Character: 中国大陆; room: RS232; Operation Temperature（℃）: -55~85℃; As-Welded: /; PCB Footprint: C0402; Temperature: -55~125℃
C109-C112 = CAP NP_Dup3: 贴片陶瓷电容,100nF,10%,25V,X5R; Manufacturer Character: 中国大陆; Operation Temperature（℃）: -55~85℃; room: RS232; As-Welded: /; PCB Footprint: C0402; Temperature: -55~125℃
CON9 = DB9_1: DB9,9PIN,90度,公头,黑色,插件; Manufacturer: 深圳市灿科盟实业有限公司（ckmtw）; Manufacturer Character: 中国大陆; As-Welded: /; Operation Temperature（℃）: -50~105℃; room: RS232; PCB Footprint: CON_DB9; Temperature: -55~105℃; Manufacturer PartNumber: D-DMR009PM-D002
J6 = CON10_0: 端子座,12PIN,间距3.81MM,90度,插件; Manufacturer: 慈溪市科发电子有限公司（KEFA）; Manufacturer Character: 中国大陆; As-Welded: /; Operation Temperature（℃）: -40~105℃; PCB Footprint: KF2EDGR-3d81-12P; Manufacturer PartNumber: KF2EDGR-3.81-12P; Temperature: -40~105℃
J7 = CON6: 端子座,6PIN,间距3.81MM,90度,插件; Manufacturer Character: 中国大陆; Manufacturer: 慈溪市科发电子有限公司（KEFA）; Operation Temperature（℃）: -40~105℃; As-Welded: /; PCB Footprint: kf2eg_3_81-6p; Manufacturer PartNumber: KF2EDGR-3.81-06P
MK1 = B_S-2W_1: DC-DC隔离电源,B0505S-1WR3L,输入电压5V,输出电压5V,输出电流max/min=200/20mA,效率max/min=78/82; Manufacturer: 广州金升阳科技有限公司（MORNSUN）; Manufacturer Character: 中国大陆; As-Welded: /; Operation Temperature（℃）: -40~105℃; Manufacturer PartNumber: B0505S-1WR3L; Temperature: -40~85℃; PCB Footprint: DIP4_B0505S_1W
R99 R111 = Resistor_Dup3: 贴片电阻,10K,±1%,1/16W; Manufacturer Character: 中国大陆; CLASS: DISCRETE; As-Welded: /; room: 6; Operation Temperature（℃）: -55~155℃; PCB Footprint: R0402; Temperature: –55~155℃
R100 R112 = Resistor_Dup3: 贴片电阻,1K,±1%,1/16W; Manufacturer Character: 中国大陆; CLASS: DISCRETE; room: 6; Operation Temperature（℃）: -55~155℃; As-Welded: /; PCB Footprint: R0402
R101 = Resistor_Dup3: 贴片电阻,120R,±1%,1/8W; Manufacturer Character: 中国大陆; CLASS: DISCRETE; room: 6; Operation Temperature（℃）: -55~155℃; As-Welded: /; PCB Footprint: R0805; Temperature: -55~125℃
R102 R114 R115 = Resistor_Dup3: 贴片电阻,10R,±1%,1/10W; Manufacturer Character: 中国大陆; CLASS: DISCRETE; room: 6; Operation Temperature（℃）: -55~155℃; As-Welded: /; PCB Footprint: R0603; Temperature: –55~155℃
R104 = Resistor_Dup3: 贴片电阻,10R,±1%,1/10W; Manufacturer Character: 中国大陆; CLASS: DISCRETE; Operation Temperature（℃）: -55~155℃; room: 6; As-Welded: /; PCB Footprint: R0603; Temperature: –55~155℃
R106 = Resistor_Dup3: 贴片电阻,1K,±1%,1/16W; Manufacturer Character: 中国大陆; CLASS: DISCRETE; As-Welded: /; room: 6; Operation Temperature（℃）: -55~155℃; PCB Footprint: R0402
R113 = Resistor_Dup3: 贴片电阻,120R,±1%,1/8W; Manufacturer Character: 中国大陆; CLASS: DISCRETE; Operation Temperature（℃）: -55~155℃; room: 6; As-Welded: /; PCB Footprint: R0805; Temperature: -55~125℃
R116 = Resistor_Dup3: 贴片电阻,1K,±1%,1/16W; Manufacturer Character: 中国大陆; CLASS: DISCRETE; Operation Temperature（℃）: -55~155℃; room: 6; As-Welded: /; PCB Footprint: R0402
R117 R118 R125 R126 = R 1%: 贴片电阻,10K,±1%,1/16W; Manufacturer Character: 中国大陆; Characteristic: 0402 1/16W +/-1%; CLASS: DISCRETE; As-Welded: /; Operation Temperature（℃）: -55~155℃; PCB Footprint: R0402; Temperature: –55~155℃
R119 R120 R123 R124 R127 R128 R131 R132 = R 1%: 贴片电阻,22R,±1%,1/16W; Manufacturer Character: 中国大陆; Characteristic: 0402 1/16W +/-1%; CLASS: DISCRETE; As-Welded: /; Operation Temperature（℃）: -55~155℃; PCB Footprint: R0402; Temperature: -55~155℃
R121 = R 1%: 贴片电阻,120R,±1%,1/8W; Manufacturer Character: 中国大陆; Characteristic: 0402 1/16W +/-1%; CLASS: DISCRETE; As-Welded: /; Operation Temperature（℃）: -55~155℃; Temperature: -55~125℃; PCB Footprint: R0805
R122 R130 = R 1%: 贴片电阻,33R,±1%,1/16W; Manufacturer Character: 中国大陆; Characteristic: 0402 1/16W +/-1%; CLASS: DISCRETE; Operation Temperature（℃）: -55~155℃; As-Welded: /; PCB Footprint: R0402; Temperature: -55~155℃
R129 = R 1%: 贴片电阻,120R,±1%,1/8W; Manufacturer Character: 中国大陆; Characteristic: 0402 1/16W +/-1%; CLASS: DISCRETE; Operation Temperature（℃）: -55~155℃; As-Welded: /; PCB Footprint: R0805; Temperature: -55~125℃
U15 U21 = ISO3082: CA-IS308x 隔离 5kV 全/半双工 RS485 收发器; Manufacturer Character: 中国大陆; Manufacturer: 上海川土微电子有限公司（Chipanalog）; As-Welded: /; room: 6; Operation Temperature（℃）: -40~125℃; Manufacturer PartNumber: CA-IS3082WX; Temperature: -40~125℃; PCB Footprint: SOIC16
U17 U25 = PSM712: TVS二极管; Manufacturer Character: 中国大陆; Manufacturer: 派克微电子（深圳）有限公司; As-Welded: /; Operation Temperature（℃）: -55~125℃; Manufacturer PartNumber: PESD2CANFD24V-K; PCB Footprint: SOT23-3
U22 U28 = PSM712: TVS二极管; Manufacturer: 派克微电子（深圳）有限公司; Manufacturer Character: 中国大陆; As-Welded: /; Operation Temperature（℃）: -55~125℃; Manufacturer PartNumber: PESD2CANFD24V-K; PCB Footprint: SOT23-3
U23 = MCP2510/2515_3: 带 SPI 接口的独立 CAN 控制器; Manufacturer: 信路达信息技术（厦门）有限（xinluda）; Manufacturer Character: 中国大陆; As-Welded: /; Operation Temperature（℃）: -40~85℃; PCB Footprint: SOIC18; Manufacturer PartNumber: XL2515; Temperature: -40~85℃
U24 = ISO1050: 隔离CAN收发器; Manufacturer: 苏州纳芯微电子股份有限公司（NOVOSENSE）; Manufacturer Character: 中国大陆; As-Welded: /; Operation Temperature（℃）: -40~125℃; PCB Footprint: SOP8; Temperature: -40~125℃; Manufacturer PartNumber: NSI1050-DDBR
U26 = MCP2510/2515_2: 带 SPI 接口的独立 CAN 控制器; Manufacturer: 信路达信息技术（厦门）有限（xinluda）; Manufacturer Character: 中国大陆; As-Welded: /; Operation Temperature（℃）: -40~85℃; PCB Footprint: SOIC18; Manufacturer PartNumber: XL2515; Temperature: -40~85℃
U27 = ISO1050: 隔离CAN收发器; Manufacturer Character: 中国大陆; Manufacturer: 苏州纳芯微电子股份有限公司（NOVOSENSE）; Operation Temperature（℃）: -40~125℃; As-Welded: /; PCB Footprint: SOP8; Manufacturer PartNumber: NSI1050-DDBR; Temperature: -40~125℃
U29 = MAX232A_0: RS232收发器; Manufacturer: 江苏芯力特电子科技有限公司（SIT）; Manufacturer Character: 中国大陆; As-Welded: /; Operation Temperature（℃）: -40~85℃; room: RS232; Manufacturer PartNumber: SIT3232EEUE; Temperature: -40~85℃; PCB Footprint: TSSOP16_PW16
Y3 Y4 = CRYSTAL: 四脚无源晶振,16MHz,±10ppm,12pF,60Ω,±30ppm; Manufacturer: 深圳市星通时频电子有限公司公司（JSCJ）; Manufacturer Character: 中国大陆; As-Welded: /; Operation Temperature（℃）: -40~85℃; PCB Footprint: SMD_3225; Manufacturer PartNumber: S3B16.000F1210F30; Temperature: -40~85℃

## Sheet P09_USB HOST_USB OTG.SchDoc
size 594 x 420 mm
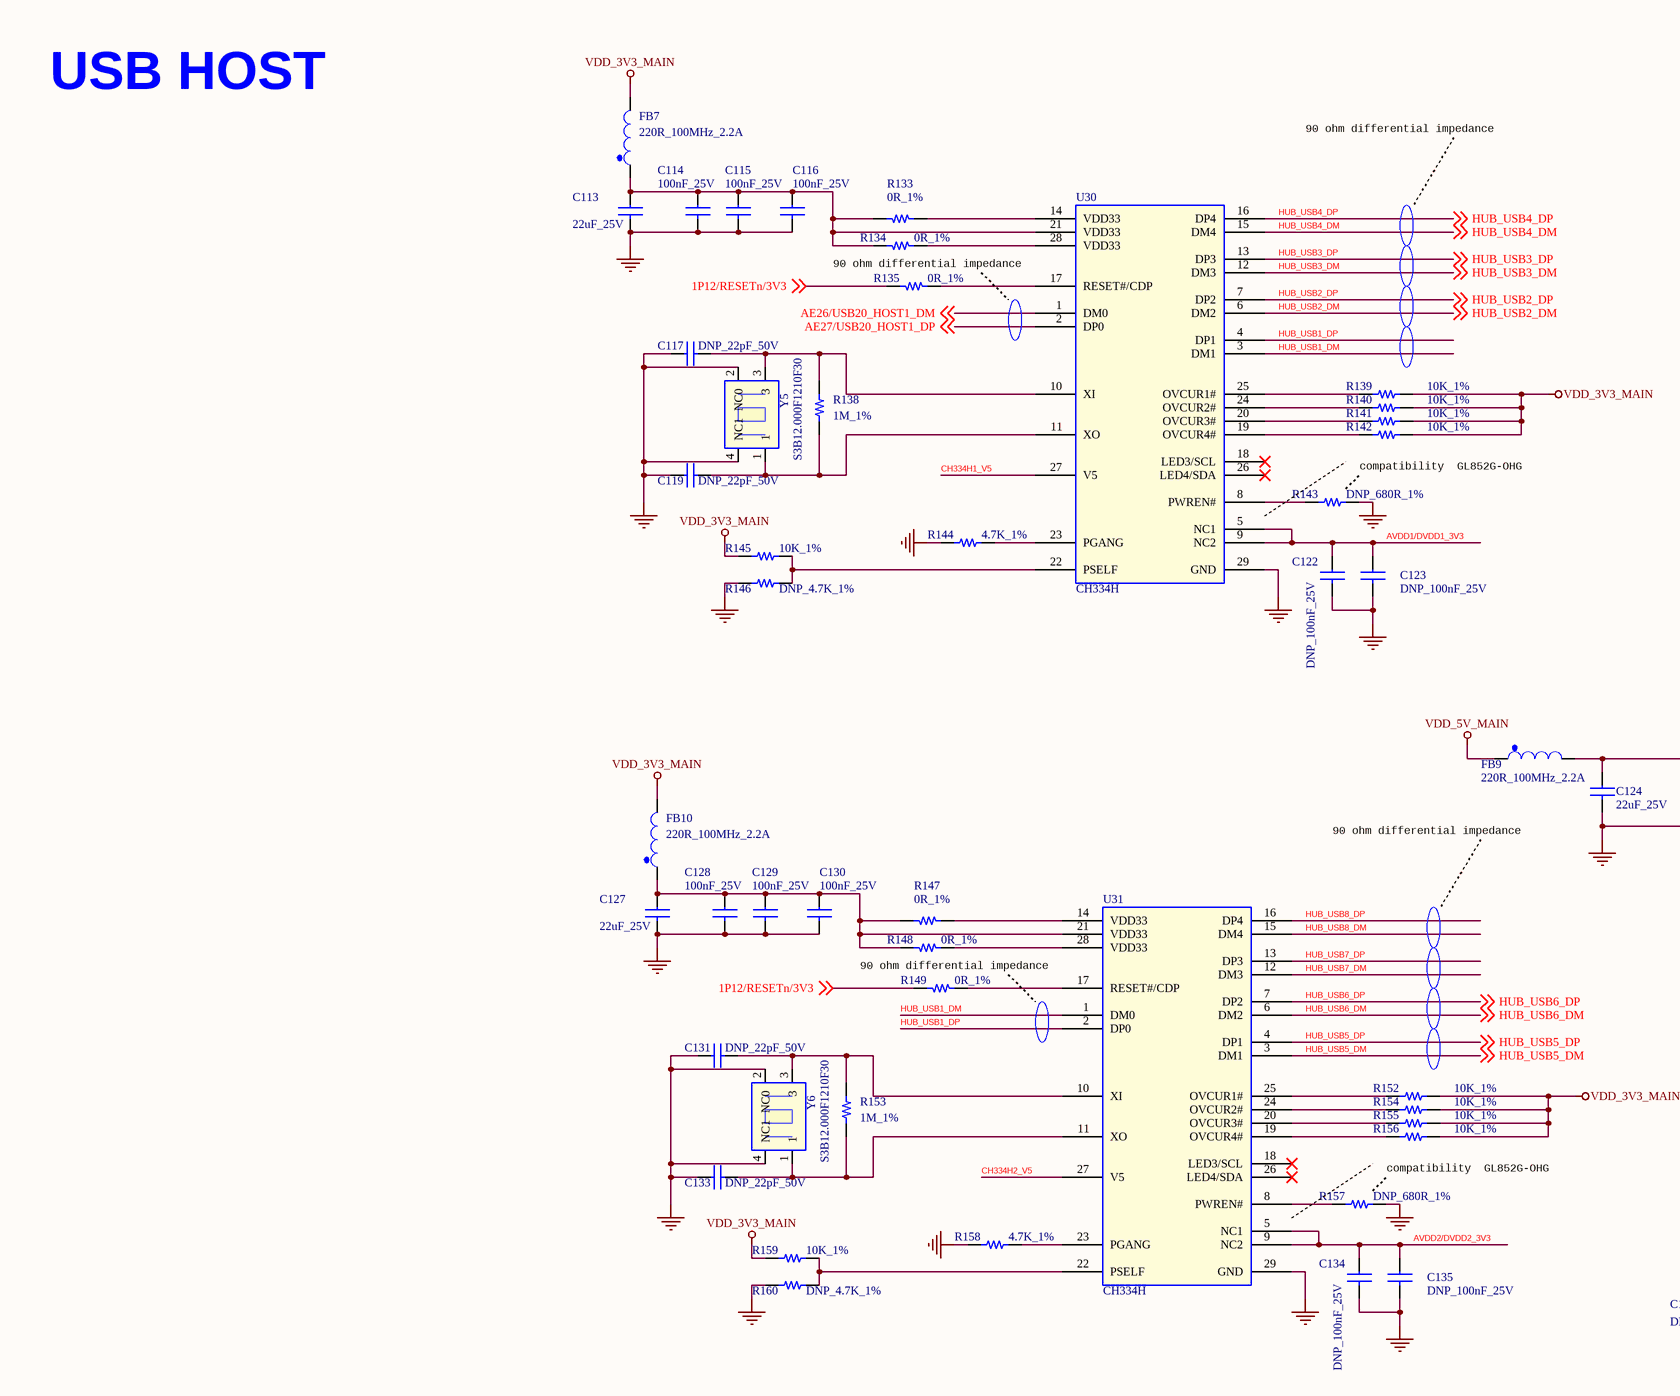
[diagram p19: P09_USB HOST_USB OTG.SchDoc, top left]
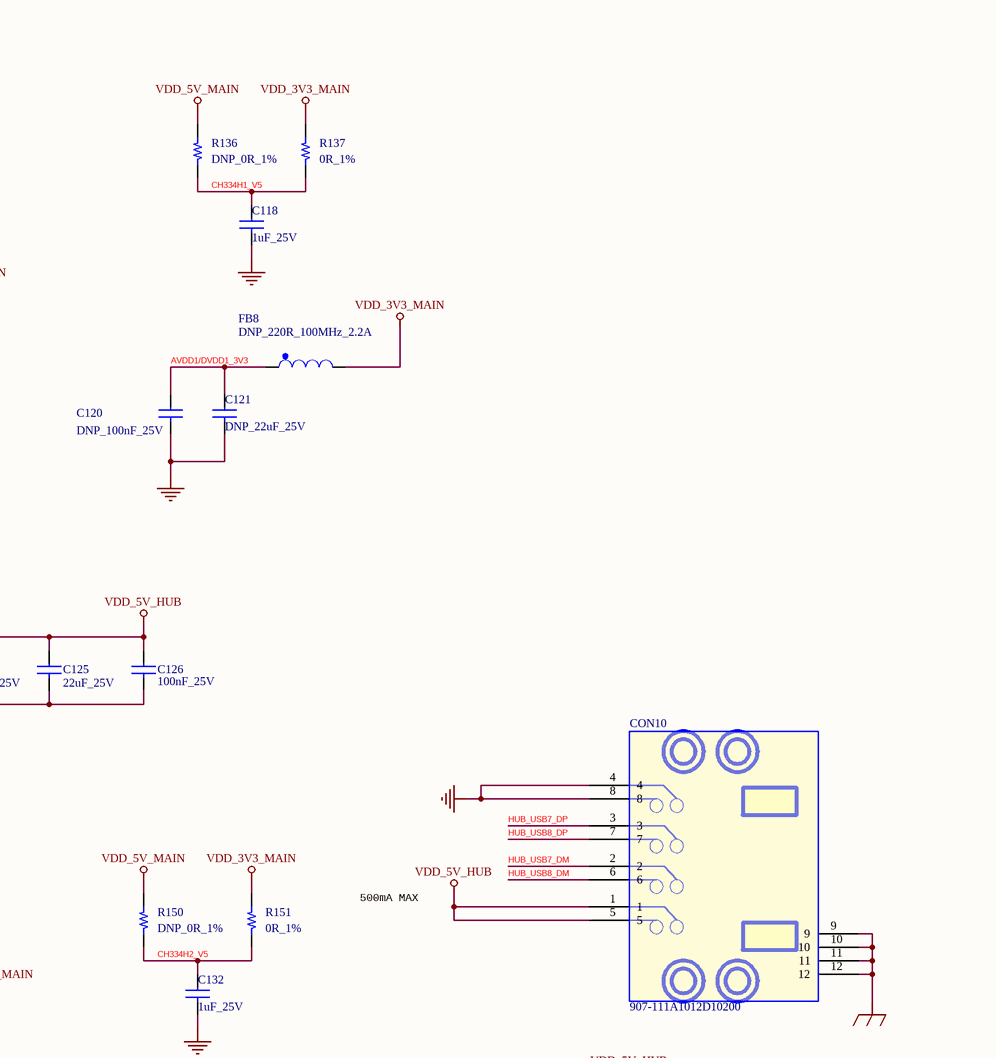
[diagram p20: P09_USB HOST_USB OTG.SchDoc, top right]
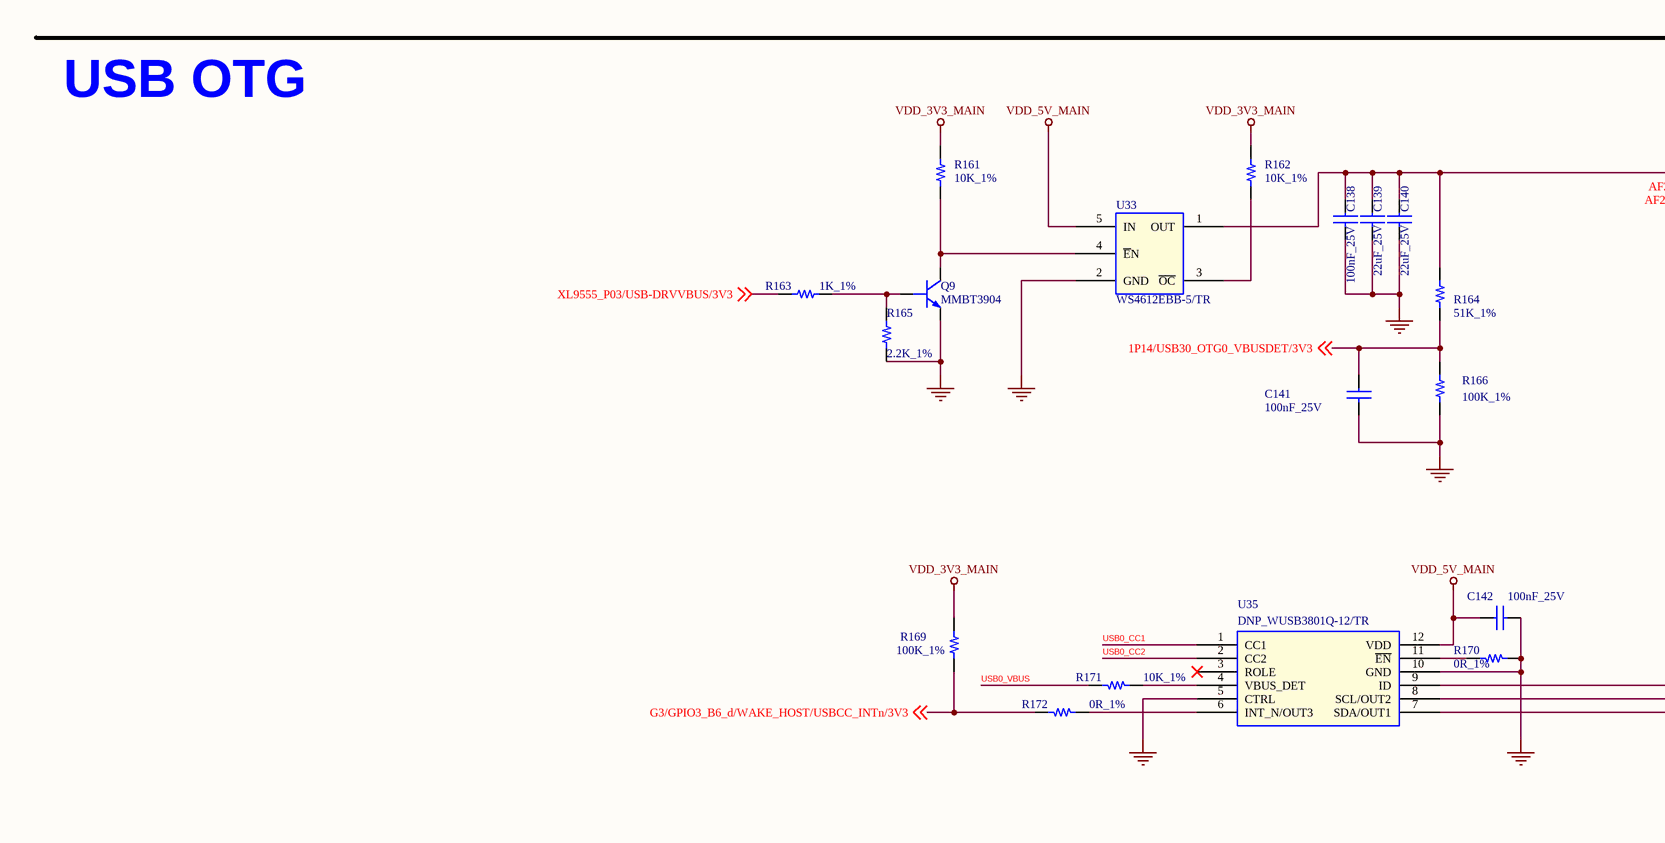
[diagram p21: P09_USB HOST_USB OTG.SchDoc, bottom left]
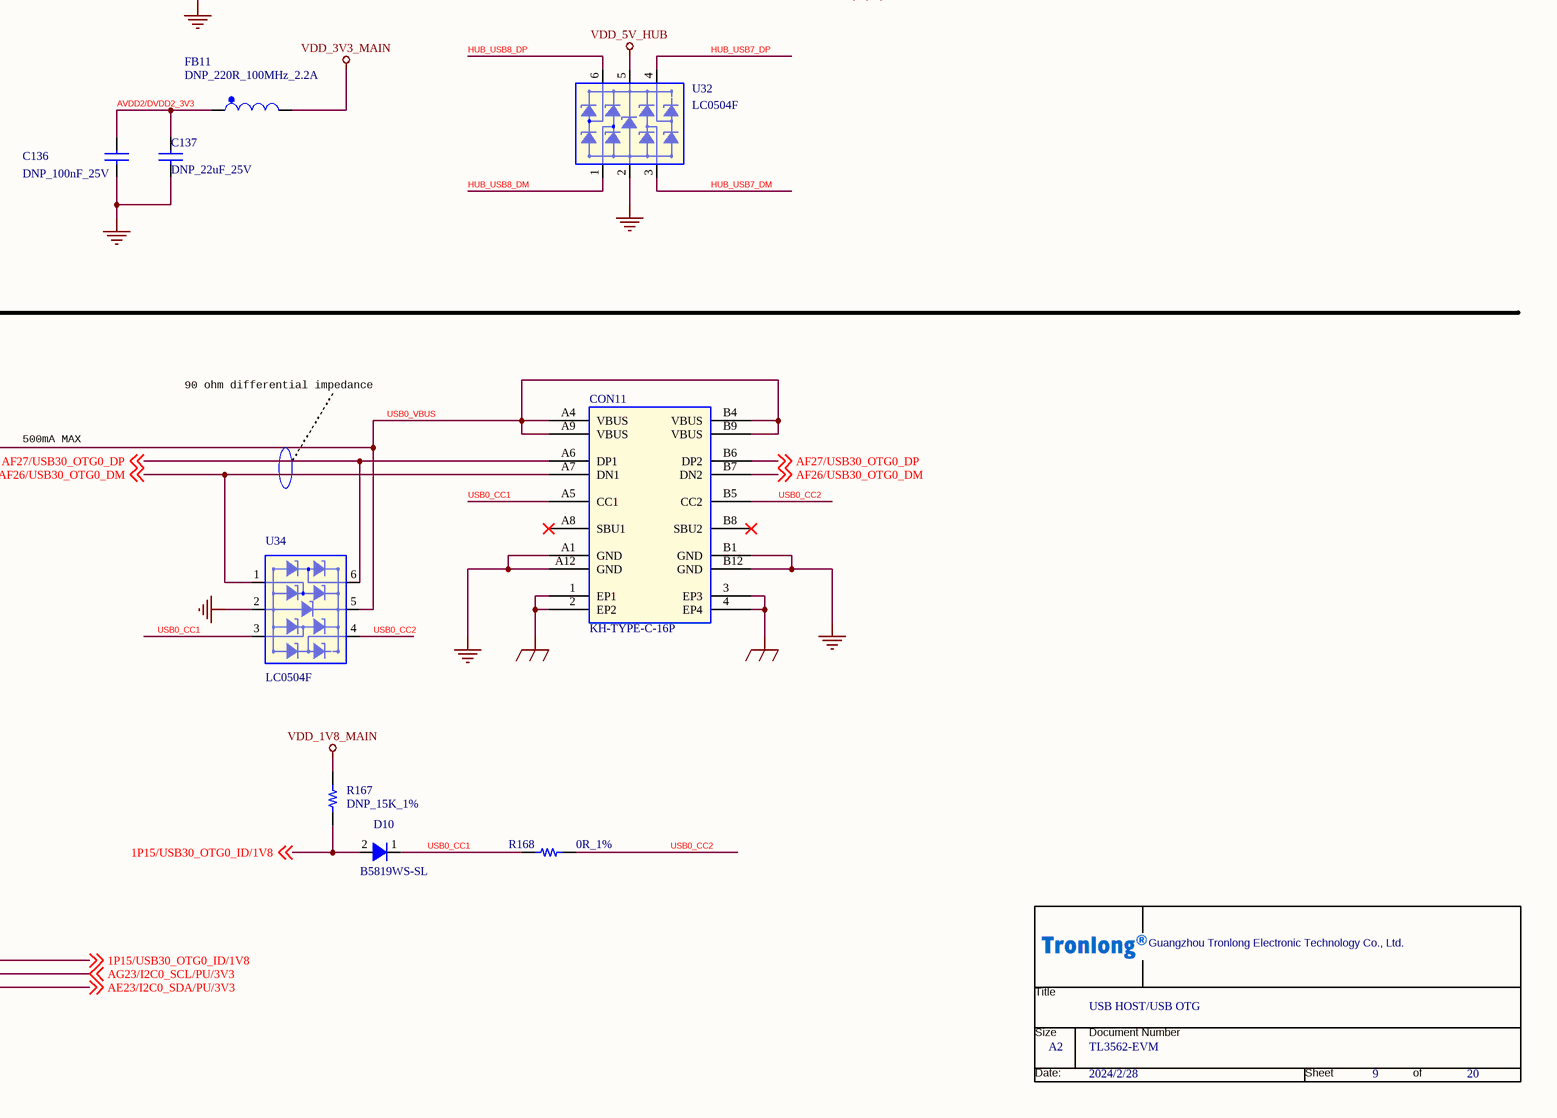
[diagram p22: P09_USB HOST_USB OTG.SchDoc, bottom right]

### Parts
(Parts that share a designator on the sheet are numbered #1, #2 ... from top to bottom, then left to right.)
*#9  Page Count: 20  Page Number: 9  Page Size: A2  OrgName: Guangzhou Tronlong Electronic Technology Co., Ltd.  Title: USB HOST/USB OTG  Doc: TL3562-EVM  Page Modify Date: 2024/2/28  (hidden comment: Tronlong_TITTLE_20211115)  (graphical)
C113  22uF_25V  [C0805]
C114  100nF_25V  [C0402]
C115  100nF_25V  [C0402]
C116  100nF_25V  [C0402]
C117  DNP_22pF_50V  [C0603]
C118  1uF_25V  [C0603]
C119  DNP_22pF_50V  [C0603]
C120  DNP_100nF_25V  [C0402]
C121  DNP_22uF_25V  [C0805]
C122  DNP_100nF_25V  [C0402]
C123  DNP_100nF_25V  [C0402]
C124  22uF_25V  [C0805]
C125  22uF_25V  [C0805]
C126  100nF_25V  [C0402]
C127  22uF_25V  [C0805]
C128  100nF_25V  [C0402]
C129  100nF_25V  [C0402]
C130  100nF_25V  [C0402]
C131  DNP_22pF_50V  [C0603]
C132  1uF_25V  [C0603]
C133  DNP_22pF_50V  [C0603]
C134  DNP_100nF_25V  [C0402]
C135  DNP_100nF_25V  [C0402]
C136  DNP_100nF_25V  [C0402]
C137  DNP_22uF_25V  [C0805]
C138  100nF_25V  [C0402]
C139  22uF_25V  [C0805]
C140  22uF_25V  [C0805]
C141  100nF_25V  [C0402]
C142  100nF_25V  [C0402]
CON10  907-111A1012D10200  [CON_USBA_DUAL]
CON11  KH-TYPE-C-16P  [TYPE-C_16P_90_SMD]
D10  B5819WS-SL  [SOD-323]
FB7  220R_100MHz_2.2A  [L0603]
FB8  DNP_220R_100MHz_2.2A  [L0603]
FB9  220R_100MHz_2.2A  [L0603]
FB10  220R_100MHz_2.2A  [L0603]
FB11  DNP_220R_100MHz_2.2A  [L0603]
Q9  MMBT3904  [SOT23-3_DBZ3]
R133  0R_1%  [R0402]
R134  0R_1%  [R0402]
R135  0R_1%  [R0402]
R136  DNP_0R_1%  [R0603]
R137  0R_1%  [R0603]
R138  1M_1%  [R0603]
R139  10K_1%  [R0402]
R140  10K_1%  [R0402]
R141  10K_1%  [R0402]
R142  10K_1%  [R0402]
R143  DNP_680R_1%  [R0603]
R144  4.7K_1%  [R0402]
R145  10K_1%  [R0402]
R146  DNP_4.7K_1%  [R0402]
R147  0R_1%  [R0402]
R148  0R_1%  [R0402]
R149  0R_1%  [R0402]
R150  DNP_0R_1%  [R0603]
R151  0R_1%  [R0603]
R152  10K_1%  [R0402]
R153  1M_1%  [R0603]
R154  10K_1%  [R0402]
R155  10K_1%  [R0402]
R156  10K_1%  [R0402]
R157  DNP_680R_1%  [R0603]
R158  4.7K_1%  [R0402]
R159  10K_1%  [R0402]
R160  DNP_4.7K_1%  [R0402]
R161  10K_1%  [R0402]
R162  10K_1%  [R0402]
R163  1K_1%  [R0402]
R164  51K_1%  [R0402]
R165  2.2K_1%  [R0603]
R166  100K_1%  [R0402]
R167  DNP_15K_1%  [R0402]
R168  0R_1%  [R0402]
R169  100K_1%  [R0402]
R170  0R_1%  [R0402]
R171  10K_1%  [R0402]
R172  0R_1%  [R0402]
U30  CH334H  [QFN28_5x5]
U31  CH334H  [QFN28_5x5]
U32  LC0504F  [SOT363]
U33  WS4612EBB-5/TR  [SOT23-5]
U34  LC0504F  [SOT363]
U35  DNP_WUSB3801Q-12/TR  [QFN1616-12L]
Y5  S3B12.000F1210F30  [SMD_3225]
Y6  S3B12.000F1210F30  [SMD_3225]

### Nets
EGND: CON10.9 CON10.10 CON10.11 CON10.12 CON11.1(EP1) CON11.2(EP2) CON11.3(EP3) CON11.4(EP4)
GND: C113.2 C114.2 C115.2 C116.2 C117.1 C118.2 C119.1 C120.2 C121.2 C122.2 C123.2 C124.2 C125.2 C126.2 C127.2 C128.2 C129.2 C130.2 C131.1 C132.2 C133.1 C134.2 C135.2 C136.2 C137.2 C138.2 C139.2 C140.2 C141.2 C142.2 CON10.4 CON10.8 CON11.A1(GND) CON11.A12(GND) CON11.B1(GND) CON11.B12(GND) Q9.2(E) R143.2 R144.2 R146.2 R157.2 R158.2 R160.2 R165.1 R166.1 R170.1 U30.29(GND) U31.29(GND) U32.2 U33.2(GND) U34.2 U35.5(CTRL) U35.10(GND) Y5.2(NC0) Y5.4(NC1) Y6.2(NC0) Y6.4(NC1)
VDD_1V8_MAIN: R167.1
VDD_3V3_MAIN: FB7.2 FB8.2 FB10.2 FB11.2 R137.2 R139.2 R140.2 R141.2 R142.2 R145.1 R151.2 R152.2 R154.2 R155.2 R156.2 R159.1 R161.1 R162.2 R169.1
VDD_5V_HUB: C124.1 C125.1 C126.1 CON10.1 CON10.5 FB9.2 U32.5
VDD_5V_MAIN: C142.1 FB9.1 R136.2 R150.2 U33.5(IN) U35.12(VDD)
1P12/RESETn/3V3: R135.2 R149.2 ; off-sheet 1P12/RESETn/3V3
1P14/USB30_OTG0_VBUSDET/3V3: C141.1 R164.1 R166.2 ; off-sheet 1P14/USB30_OTG0_VBUSDET/3V3
1P15/USB30_OTG0_ID/1V8: D10.2(Cathode) R167.2 U35.9(ID) ; off-sheet 1P15/USB30_OTG0_ID/1V8
AE23/I2C0_SDA/PU/3V3: U35.7(SDA/OUT1) ; off-sheet AE23/I2C0_SDA/PU/3V3  [project net I2C0_SDA]
AE26/USB20_HOST1_DM: U30.1(DM0) ; off-sheet AE26/USB20_HOST1_DM
AE27/USB20_HOST1_DP: U30.2(DP0) ; off-sheet AE27/USB20_HOST1_DP
AF26/USB30_OTG0_DM: CON11.A7(DN1) CON11.B7(DN2) U34.1 ; off-sheet AF26/USB30_OTG0_DM
AF27/USB30_OTG0_DP: CON11.A6(DP1) CON11.B6(DP2) U34.6 ; off-sheet AF27/USB30_OTG0_DP
AG23/I2C0_SCL/PU/3V3: U35.8(SCL/OUT2) ; off-sheet AG23/I2C0_SCL/PU/3V3  [project net I2C0_SCL]
AVDD1/DVDD1_3V3: C120.1 C121.1 C122.1 C123.1 FB8.1 U30.5(NC1) U30.9(NC2)
AVDD2/DVDD2_3V3: C134.1 C135.1 C136.1 C137.1 FB11.1 U31.5(NC1) U31.9(NC2)
CH334H1_V5: C118.1 R136.1 R137.1 U30.27(V5)
CH334H2_V5: C132.1 R150.1 R151.1 U31.27(V5)
G3/GPIO3_B6_d/WAKE_HOST/USBCC_INTn/3V3: R169.2 R172.2 ; off-sheet G3/GPIO3_B6_d/WAKE_HOST/USBCC_INTn/3V3  [project net SDC_WAKE_HOST/3V3]
HUB_USB1_DM: U30.3(DM1) U31.1(DM0)
HUB_USB1_DP: U30.4(DP1) U31.2(DP0)
HUB_USB2_DM: U30.6(DM2) ; off-sheet HUB_USB2_DM
HUB_USB2_DP: U30.7(DP2) ; off-sheet HUB_USB2_DP
HUB_USB3_DM: U30.12(DM3) ; off-sheet HUB_USB3_DM
HUB_USB3_DP: U30.13(DP3) ; off-sheet HUB_USB3_DP
HUB_USB4_DM: U30.15(DM4) ; off-sheet HUB_USB4_DM
HUB_USB4_DP: U30.16(DP4) ; off-sheet HUB_USB4_DP
HUB_USB5_DM: U31.3(DM1) ; off-sheet HUB_USB5_DM
HUB_USB5_DP: U31.4(DP1) ; off-sheet HUB_USB5_DP
HUB_USB6_DM: U31.6(DM2) ; off-sheet HUB_USB6_DM
HUB_USB6_DP: U31.7(DP2) ; off-sheet HUB_USB6_DP
HUB_USB7_DM: CON10.2 U31.12(DM3) U32.3
HUB_USB7_DP: CON10.3 U31.13(DP3) U32.4
HUB_USB8_DM: CON10.6 U31.15(DM4) U32.1
HUB_USB8_DP: CON10.7 U31.16(DP4) U32.6
USB0_CC1: CON11.A5(CC1) D10.1(Anode) R168.2 U34.3 U35.1(CC1)
USB0_CC2: CON11.B5(CC2) R168.1 U34.4 U35.2(CC2)
USB0_VBUS: C138.1 C139.1 C140.1 CON11.A4(VBUS) CON11.A9(VBUS) CON11.B4(VBUS) CON11.B9(VBUS) R164.2 R171.2 U33.1(OUT) U34.5
XL9555_P03/USB-DRVVBUS/3V3: R163.2 ; off-sheet XL9555_P03/USB-DRVVBUS/3V3
NetC113_1: C113.1 C114.1 C115.1 C116.1 FB7.1 R133.1 R134.1 U30.21(VDD33)
NetC117_2: C117.2 R138.1 U30.10(XI) Y5.3
NetC119_2: C119.2 R138.2 U30.11(XO) Y5.1
NetC127_1: C127.1 C128.1 C129.1 C130.1 FB10.1 R147.1 R148.1 U31.21(VDD33)
NetC131_2: C131.2 R153.1 U31.10(XI) Y6.3
NetC133_2: C133.2 R153.2 U31.11(XO) Y6.1
NetQ9_1: Q9.1(B) R163.1 R165.2
NetQ9_3: Q9.3(C) R161.2 U33.4(~{E}N)
NetR133_2: R133.2 U30.14(VDD33)
NetR134_2: R134.2 U30.28(VDD33)
NetR135_1: R135.1 U30.17(RESET#/CDP)
NetR139_1: R139.1 U30.25(OVCUR1#)
NetR140_1: R140.1 U30.24(OVCUR2#)
NetR141_1: R141.1 U30.20(OVCUR3#)
NetR142_1: R142.1 U30.19(OVCUR4#)
NetR143_1: R143.1 U30.8(PWREN#)
NetR144_1: R144.1 U30.23(PGANG)
NetR145_2: R145.2 R146.1 U30.22(PSELF)
NetR147_2: R147.2 U31.14(VDD33)
NetR148_2: R148.2 U31.28(VDD33)
NetR149_1: R149.1 U31.17(RESET#/CDP)
NetR152_1: R152.1 U31.25(OVCUR1#)
NetR154_1: R154.1 U31.24(OVCUR2#)
NetR155_1: R155.1 U31.20(OVCUR3#)
NetR156_1: R156.1 U31.19(OVCUR4#)
NetR157_1: R157.1 U31.8(PWREN#)
NetR158_1: R158.1 U31.23(PGANG)
NetR159_2: R159.2 R160.1 U31.22(PSELF)
NetR162_1: R162.1 U33.3(~{OC})
NetR170_2: R170.2 U35.11(~{EN})
NetR171_1: R171.1 U35.4(VBUS_DET)
NetR172_1: R172.1 U35.6(INT_N/OUT3)

Not connected (* = marked no-connect by the designer): CON11 A8(SBU1)* B8(SBU2)*; U30 18(LED3/SCL)* 26(LED4/SDA)*; U31 18(LED3/SCL)* 26(LED4/SDA)*; U35 3(ROLE)*

### Notes on the sheet
- USB HOST
- 90 ohm differential impedance
- compatibility  GL852G-OHG
- 500mA MAX
- USB OTG
- (in symbol Tronlong_TITTLE_20211115) Title; Size; Document Number; Date:; Sheet; of

### Library data of the parts
*#9 = Tronlong_TITTLE_20211115: RevCode: A?; Page Create Date: March  8, 1995
C113 = CAP NP_Dup3: 贴片陶瓷电容,22uF,20%,25V,X5R; Manufacturer Character: 中国大陆; room: USB HUB; Operation Temperature（℃）: -55~85℃; As-Welded: /; Temperature: -55~125℃; PCB Footprint: C0805
C114 C116 C129 = CAP NP_Dup3: 贴片陶瓷电容,100nF,10%,25V,X5R; Manufacturer Character: 中国大陆; As-Welded: /; Operation Temperature（℃）: -55~85℃; room: USB HUB; Temperature: -55~125℃; PCB Footprint: C0402
C115 C126 C128 C130 = CAP NP_Dup3: 贴片陶瓷电容,100nF,10%,25V,X5R; Manufacturer Character: 中国大陆; As-Welded: /; room: USB HUB; Operation Temperature（℃）: -55~85℃; Temperature: -55~125℃; PCB Footprint: C0402
C117 C119 = CAP NP_Dup3: 贴片陶瓷电容,22pF,5%,50V,COG; Manufacturer Character: 中国大陆; Operation Temperature（℃）: -55~125℃; As-Welded: DNP; room: USB HUB; Temperature: -55~125℃; PCB Footprint: C0603
C118 C132 = CAP NP_Dup3: 贴片陶瓷电容,1uF,10%,25V,X5R; Manufacturer Character: 中国大陆; As-Welded: /; Operation Temperature（℃）: -55~85℃; room: USB HUB; PCB Footprint: C0603
C120 C122 C136 = CAP NP_Dup3: 100nF,10%,C0402,25V; Manufacturer Character: 中国大陆; Operation Temperature（℃）: -40~85℃; As-Welded: DNP; room: USB HUB; Temperature: -55~125℃; PCB Footprint: C0402
C121 = CAP NP_Dup3: 贴片陶瓷电容,22uF,10%,16V,X5R; Manufacturer Character: 中国大陆; room: USB HUB; As-Welded: DNP; Operation Temperature（℃）: -55~85℃; Temperature: -55~125℃; PCB Footprint: C0805
C123 C134 C135 = CAP NP_Dup3: 100nF,10%,C0402,25V; Manufacturer Character: 中国大陆; room: USB HUB; As-Welded: DNP; Operation Temperature（℃）: -40~85℃; Temperature: -55~125℃; PCB Footprint: C0402
C124 C125 C127 = CAP NP_Dup3: 贴片陶瓷电容,22uF,20%,25V,X5R; Manufacturer Character: 中国大陆; Operation Temperature（℃）: -55~85℃; room: USB HUB; As-Welded: /; Temperature: -55~125℃; PCB Footprint: C0805
C131 C133 = CAP NP_Dup3: 贴片陶瓷电容,22pF,5%,50V,COG; Manufacturer Character: 中国大陆; room: USB HUB; As-Welded: DNP; Operation Temperature（℃）: -55~125℃; Temperature: -55~125℃; PCB Footprint: C0603
C137 = CAP NP_Dup3: 贴片陶瓷电容,22uF,10%,16V,X5R; Manufacturer Character: 中国大陆; Operation Temperature（℃）: -55~85℃; As-Welded: DNP; room: USB HUB; Temperature: -55~125℃; PCB Footprint: C0805
C138 = CAP NP_Dup1: 贴片陶瓷电容,100nF,10%,25V,X5R; Manufacturer Character: 中国大陆; As-Welded: /; Operation Temperature（℃）: -55~85℃; room: DRDUSB; Temperature: -55~125℃; PCB Footprint: C0402
C139 C140 = CAP NP_Dup1: 贴片陶瓷电容,22uF,20%,25V,X5R; Manufacturer Character: 中国大陆; Operation Temperature（℃）: -55~85℃; room: DRDUSB; As-Welded: /; Temperature: -55~125℃; PCB Footprint: C0805
C141 = CAP NP_Dup1: 贴片陶瓷电容,100nF,10%,25V,X5R; Manufacturer Character: 中国大陆; Operation Temperature（℃）: -55~85℃; As-Welded: /; room: DRDUSB; Temperature: -55~125℃; PCB Footprint: C0402
C142 = CAP NP_Dup1: 贴片陶瓷电容,100nF,10%,25V,X5R; Manufacturer Character: 中国大陆; As-Welded: /; Operation Temperature（℃）: -55~85℃; room: USB HUB; Temperature: -55~125℃; PCB Footprint: C0402
CON10 = DOUBLE USB A TYPE: USB-A-双层座,8PIN,90度,母座,插件; Manufacturer PartNumber: FUS208-FDBW3K; Manufacturer: 深圳特思嘉工业电子有限公司（TXGA）; Manufacturer Character: 中国大陆; Operation Temperature（℃）: -40~85℃; room: USB HUB; As-Welded: /; PCB Footprint: CON_USBA_DUAL
CON11 = usb 3_0.0 type-c female: Type-C 母座 90度 16 Pin; Manufacturer Character: 中国大陆; Manufacturer: 深圳市金航标电子有限公司(kinghelm); Operation Temperature（℃）: -40~85℃; room: 10; As-Welded: /; PCB Footprint: TYPE-C_16P_90_SMD; Manufacturer PartNumber: KH-TYPE-C-16P
D10 = Diode200mA250V_2: 肖特基二极管,VR=40V,IF=1A,VF=0.6V@1A; TIIntPartnumber: 1E0013; MfrNum: MMSD103T1G; Mfr: On Semiconductor; Manufacturer Character: 中国大陆; Manufacturer: 江苏长晶科技有限公司（JSCJ）; DescriptiveText: Diode 200mA 250V 1.25V Forward Drop; PCB Footprint: smd123; Cost10K: 0.07; Cost100: 0.23; Vendor: Digikey; Operation Temperature（℃）: -55~125℃; As-Welded: /; PartName: Diode200mA250V; Descriptive_Text: Diode 200mA 250V 1.25V Forward Drop; Temperature: -40~125℃; Manufacturer PartNumber: B5819WS-SL
FB7 = FERRITE BEAD_Dup1: 磁珠,50mΩ,2.2A,220R@100MHz; Manufacturer Character: 中国大陆; Manufacturer: 深圳顺络电子股份有限公司（Sunlord）; Manufacturer PartNumber: UPZ1608U221-2R2TF; room: USB HUB; Operation Temperature（℃）: -55~125℃; As-Welded: /; PCB Footprint: L0603; Temperature: -55~+125(Ta)
FB8 FB11 = FERRITE BEAD_Dup1: 磁珠,50mΩ,2.2A,220R@100MHz; Manufacturer Character: 中国大陆; Manufacturer: 深圳顺络电子股份有限公司（Sunlord）; Manufacturer PartNumber: UPZ1608U221-2R2TF; room: USB HUB; As-Welded: DNP; Operation Temperature（℃）: -55~125℃; PCB Footprint: L0603; Temperature: -55~125℃
FB9 FB10 = FERRITE BEAD_Dup1: 磁珠,50mΩ,2.2A,220R@100MHz; Manufacturer PartNumber: UPZ1608U221-2R2TF; Manufacturer: 深圳顺络电子股份有限公司（Sunlord）; Manufacturer Character: 中国大陆; Operation Temperature（℃）: -55~125℃; room: USB HUB; As-Welded: /; PCB Footprint: L0603; Temperature: -55~+125(Ta)
Q9 = MMBT3904/SOT: BJT,NPN,Vceo=40V,Ic=200mA,fT=300MHz,PD=200mW; Manufacturer Character: 中国大陆; Manufacturer: 江苏长晶科技有限公司（JSCJ）; Operation Temperature（℃）: -55~150℃; As-Welded: /; Temperature: -55~150℃; Manufacturer PartNumber: MMBT3904; PCB Footprint: SOT23-3_DBZ3
R133-R135 R147-R149 = Resistor_Dup3: 0R,±1%,R0402,≥1/16W; Manufacturer Character: 中国大陆; CLASS: DISCRETE; As-Welded: /; Operation Temperature（℃）: -55~155℃; PCB Footprint: R0402
R136 R150 = Resistor_Dup3: 贴片电阻,0R,±1%,1/10W; Manufacturer Character: 中国大陆; CLASS: DISCRETE; As-Welded: DNP; Operation Temperature（℃）: -55~155℃; PCB Footprint: R0603
R137 R151 = Resistor_Dup3: 0R,±1%,R0603,≥1/10W; Manufacturer Character: 中国大陆; CLASS: DISCRETE; As-Welded: /; Operation Temperature（℃）: -55~155℃; Temperature: –55~155℃; PCB Footprint: R0603
R138 = Resistor_Dup3: 贴片电阻,1M,±1%,1/10W; Manufacturer Character: 中国大陆; CLASS: DISCRETE; As-Welded: /; Operation Temperature（℃）: -55~155℃; room: USB HUB; PCB Footprint: R0603
R139-R142 R145 = Resistor_Dup3: 贴片电阻,10K,±1%,1/16W; Manufacturer Character: 中国大陆; CLASS: DISCRETE; Operation Temperature（℃）: -55~155℃; room: USB HUB; As-Welded: /; Temperature: –55~155℃; PCB Footprint: R0402
R143 = Resistor_Dup3: 贴片电阻,680R,±1%,1/10W; Manufacturer Character: 中国大陆; CLASS: DISCRETE; room: USB HUB; As-Welded: DNP; Operation Temperature（℃）: -55~155℃; Temperature: -55~155℃; PCB Footprint: R0603
R144 R158 = Resistor_Dup3: 贴片电阻,4.7K,±1%,1/16W; Manufacturer Character: 中国大陆; CLASS: DISCRETE; As-Welded: /; Operation Temperature（℃）: -55~155℃; Temperature: -55~155℃; PCB Footprint: R0402
R146 = Resistor_Dup3: 贴片电阻,4.7K,±1%,1/16W; Manufacturer Character: 中国大陆; CLASS: DISCRETE; Operation Temperature（℃）: -55~155℃; As-Welded: DNP; PCB Footprint: R0402; Temperature: -55~155℃
R152 R154-R156 R159 = Resistor_Dup3: 贴片电阻,10K,±1%,1/16W; Manufacturer Character: 中国大陆; CLASS: DISCRETE; room: USB HUB; Operation Temperature（℃）: -55~155℃; As-Welded: /; Temperature: –55~155℃; PCB Footprint: R0402
R153 = Resistor_Dup3: 贴片电阻,1M,±1%,1/10W; Manufacturer Character: 中国大陆; CLASS: DISCRETE; As-Welded: /; room: USB HUB; Operation Temperature（℃）: -55~155℃; PCB Footprint: R0603
R157 = Resistor_Dup3: 贴片电阻,680R,±1%,1/10W; Manufacturer Character: 中国大陆; CLASS: DISCRETE; Operation Temperature（℃）: -55~155℃; As-Welded: DNP; room: USB HUB; Temperature: -55~155℃; PCB Footprint: R0603
R160 = Resistor_Dup3: 贴片电阻,4.7K,±1%,1/16W; Manufacturer Character: 中国大陆; CLASS: DISCRETE; As-Welded: DNP; Operation Temperature（℃）: -55~155℃; PCB Footprint: R0402; Temperature: -55~155℃
R161 = R 1%: 贴片电阻,10K,±1%,1/16W; Manufacturer Character: 中国大陆; Characteristic: 0402 1/16W +/-1%; CLASS: DISCRETE; Operation Temperature（℃）: -55~155℃; As-Welded: /; room: DRDUSB; Temperature: –55~155℃; PCB Footprint: R0402
R162 = R 1%: 贴片电阻,10K,±1%,1/16W; Manufacturer Character: 中国大陆; Characteristic: 0402 1/16W +/-1%; CLASS: DISCRETE; room: DRDUSB; Operation Temperature（℃）: -55~155℃; As-Welded: /; Temperature: –55~155℃; PCB Footprint: R0402
R163 = Resistor_Dup3: 贴片电阻,1K,±1%,1/16W; Manufacturer Character: 中国大陆; CLASS: DISCRETE; Operation Temperature（℃）: -55~155℃; As-Welded: /; PCB Footprint: R0402
R164 = R 1%: 贴片电阻,51K,±1%,1/16W; Manufacturer Character: 中国大陆; Mistral Part No: 110009031036-R; Mfr_name: PANASONIC-ECG; Mfr_part_number: ERJ-2RNF6981V; Part_type: RESISTORS\FIXED; Characteristic: 0402 1/16W +/-1%; CLASS: DISCRETE; Operation Temperature（℃）: -55~155℃; Project: TELEMETRY ENCODER; Customs_HS_Code: 85332119; Custom_Duty: 15%; As-Welded: /; Temperature: -55~155℃; Tolerance: 1%; Package: 0402; Distributor_name: NA; Distributor_part_number: NA; Height: 0.40MM; Datasheet: Y:\MIS_DATABASE\DATASHEETS\RESISTORS\PAN_ERJ.PDF; Crtd /date: MAZHAR/090807; PCB Footprint: R0402
R165 = Resistor_Dup3: 贴片电阻,2.2K,±1%,1/10W; Manufacturer Character: 中国大陆; CLASS: DISCRETE; As-Welded: /; Operation Temperature（℃）: -55~155℃; PCB Footprint: R0603
R166 = R 1%: 贴片电阻,100K,±1%,1/16W; Manufacturer Character: 中国大陆; Characteristic: 0402 1/16W +/-1%; CLASS: DISCRETE; Operation Temperature（℃）: -55~155℃; As-Welded: /; room: USB HUB; PCB Footprint: R0402; Temperature: -55~155℃
R167 = R 1%: 贴片电阻,15K,±1%,1/16W; Manufacturer Character: 中国大陆; Characteristic: 0402 1/16W +/-1%; CLASS: DISCRETE; Operation Temperature（℃）: -55~155℃; room: DRDUSB; As-Welded: DNP; PCB Footprint: R0402; Temperature: -55~125℃
R168 = 10_R_0: 0R,±1%,R0402,≥1/16W; Manufacturer Character: 中国大陆; CLASS: DISCRETE; room: ecat1; Operation Temperature（℃）: -55~155℃; As-Welded: /; Temperature: -55~155℃; PCB Footprint: R0402
R169 = R 1%: 贴片电阻,100K,±1%,1/16W; Manufacturer Character: 中国大陆; Characteristic: 0402 1/16W +/-1%; CLASS: DISCRETE; As-Welded: /; Operation Temperature（℃）: -55~155℃; room: DRDUSB; PCB Footprint: R0402; Temperature: -55~125℃
R170 R172 = R 1%: 0R,±1%,R0402,≥1/16W; Manufacturer Character: 中国大陆; Characteristic: 0402 1/16W +/-1%; CLASS: DISCRETE; As-Welded: /; room: USB HUB; Operation Temperature（℃）: -55~155℃; Temperature: -55~125℃; PCB Footprint: R0402
R171 = R 1%: 贴片电阻,10K,±1%,1/16W; Manufacturer Character: 中国大陆; Characteristic: 0402 1/16W +/-1%; CLASS: DISCRETE; room: USB HUB; Operation Temperature（℃）: -55~155℃; As-Welded: /; Temperature: -55~125℃; PCB Footprint: R0402
U30 = GL852GT_1: USB HUB控制器; Manufacturer: 南京沁恒微电子股份有限公司（WCH）; Manufacturer Character: 中国大陆; Operation Temperature（℃）: -40~85℃; room: USB HUB; As-Welded: /; PCB Footprint: QFN28_5x5; Temperature: -40~85℃; Manufacturer PartNumber: CH334H
U31 = GL852GT_1: USB HUB控制器; Manufacturer Character: 中国大陆; Manufacturer: 南京沁恒微电子股份有限公司（WCH）; room: USB HUB; Operation Temperature（℃）: -40~85℃; As-Welded: /; PCB Footprint: QFN28_5x5; Manufacturer PartNumber: CH334H; Temperature: -40~85℃
U32 = PRTR5V0U4Y: ESD二极管,VRWM=5V,VBR=6V,四组,单向,8KV,15KV; Manufacturer Character: 中国大陆; Manufacturer: 上海雷卯电子科技有限公司（Leiditech）; room: DRDUSB; Operation Temperature（℃）: -55~125℃; As-Welded: /; PCB Footprint: SOT363; Temperature: -40~85℃; Manufacturer PartNumber: LC0504F
U33 = TPS2041BDGN_0: 限流配电开关,2.5V~5.5V,1.4A; Manufacturer Character: 中国大陆; Manufacturer: 上海韦尔半导体股份有限公司（WILLSEMI）; Operation Temperature（℃）: -40~85℃; room: DRDUSB; As-Welded: /; Temperature: -40~85℃; Manufacturer PartNumber: WS4612EBB-5/TR; PCB Footprint: SOT23-5
U34 = PRTR5V0U4Y: ESD二极管,VRWM=5V,VBR=6V,四组,单向,8KV,15KV; Manufacturer Character: 中国大陆; Manufacturer: 上海雷卯电子科技有限公司（Leiditech）; Operation Temperature（℃）: -55~125℃; room: DRDUSB; As-Welded: /; Manufacturer PartNumber: LC0504F; Temperature: -40~85℃; PCB Footprint: SOT363
U35 = TPS54286PWP_2: USB Type-C配置通道适配器芯片; Manufacturer: 上海韦尔半导体股份有限公司（WILLSEMI）; Manufacturer Character: 中国大陆; Operation Temperature（℃）: -40~125℃; As-Welded: DNP; PCB Footprint: QFN1616-12L; Manufacturer PartNumber: WUSB3801Q-12/TR
Y5 = CRYSTAL: 四脚无源晶振,12MHz,±10ppm,12pF,100Ω,±30ppm; Manufacturer: 深圳市星通时频电子有限公司公司（JSCJ）; Manufacturer Character: 中国大陆; Operation Temperature（℃）: -40~85℃; room: USB HUB; As-Welded: /; PCB Footprint: SMD_3225; Temperature: -40~85℃; Manufacturer PartNumber: S3B12.000F1210F30
Y6 = CRYSTAL: 四脚无源晶振,12MHz,±10ppm,12pF,100Ω,±30ppm; Manufacturer Character: 中国大陆; Manufacturer: 深圳市星通时频电子有限公司公司（JSCJ）; room: USB HUB; Operation Temperature（℃）: -40~85℃; As-Welded: /; PCB Footprint: SMD_3225; Manufacturer PartNumber: S3B12.000F1210F30; Temperature: -40~85℃